# Altium project Ovladaci_karta.PrjPcb (part 1 of 2)
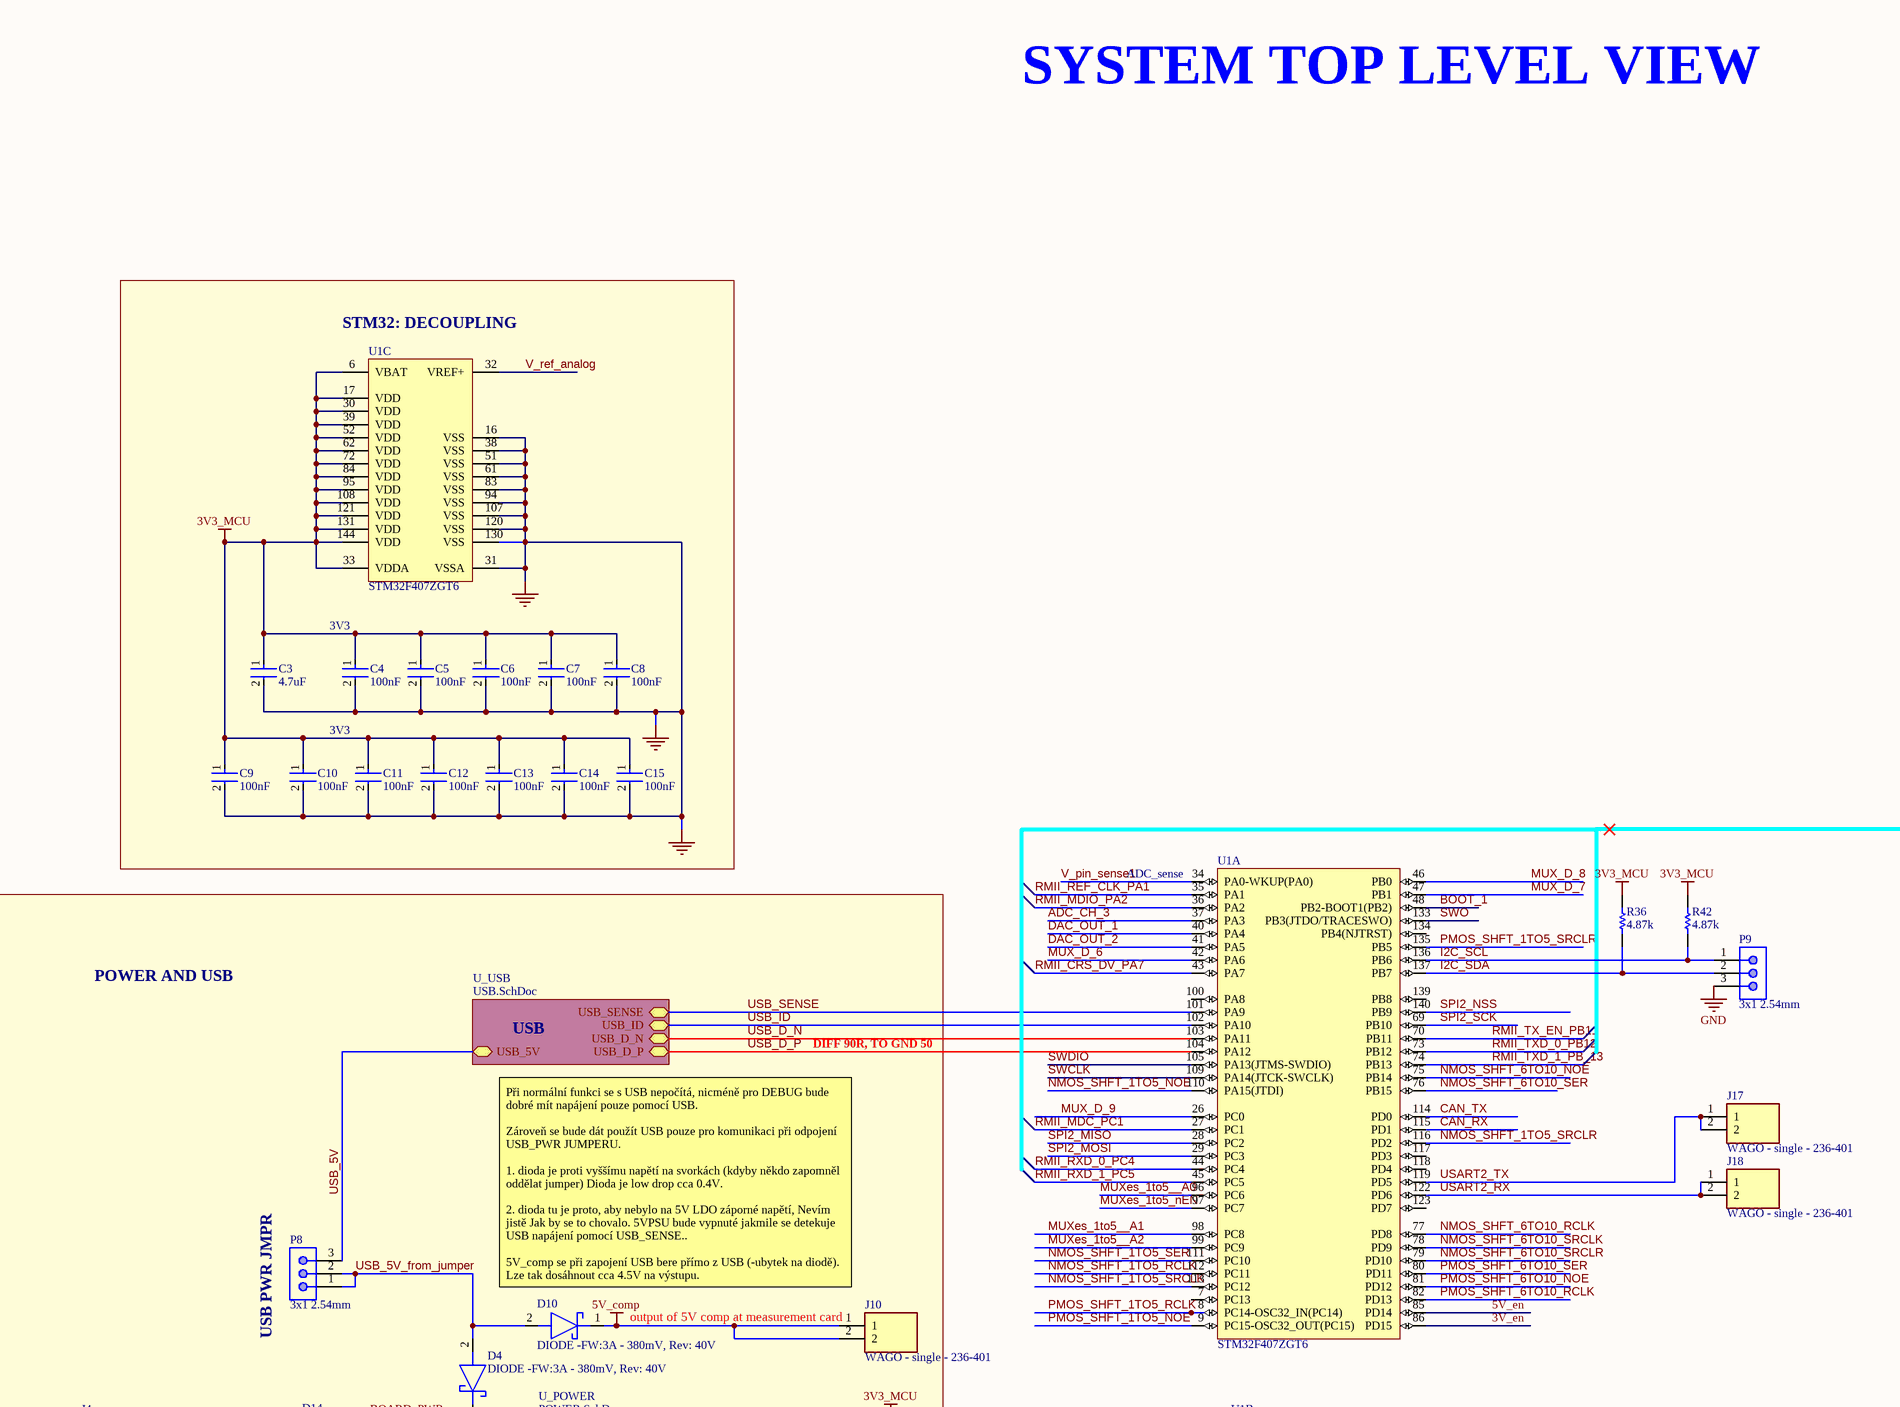
[diagram p0: main_scheme.SchDoc, top left]
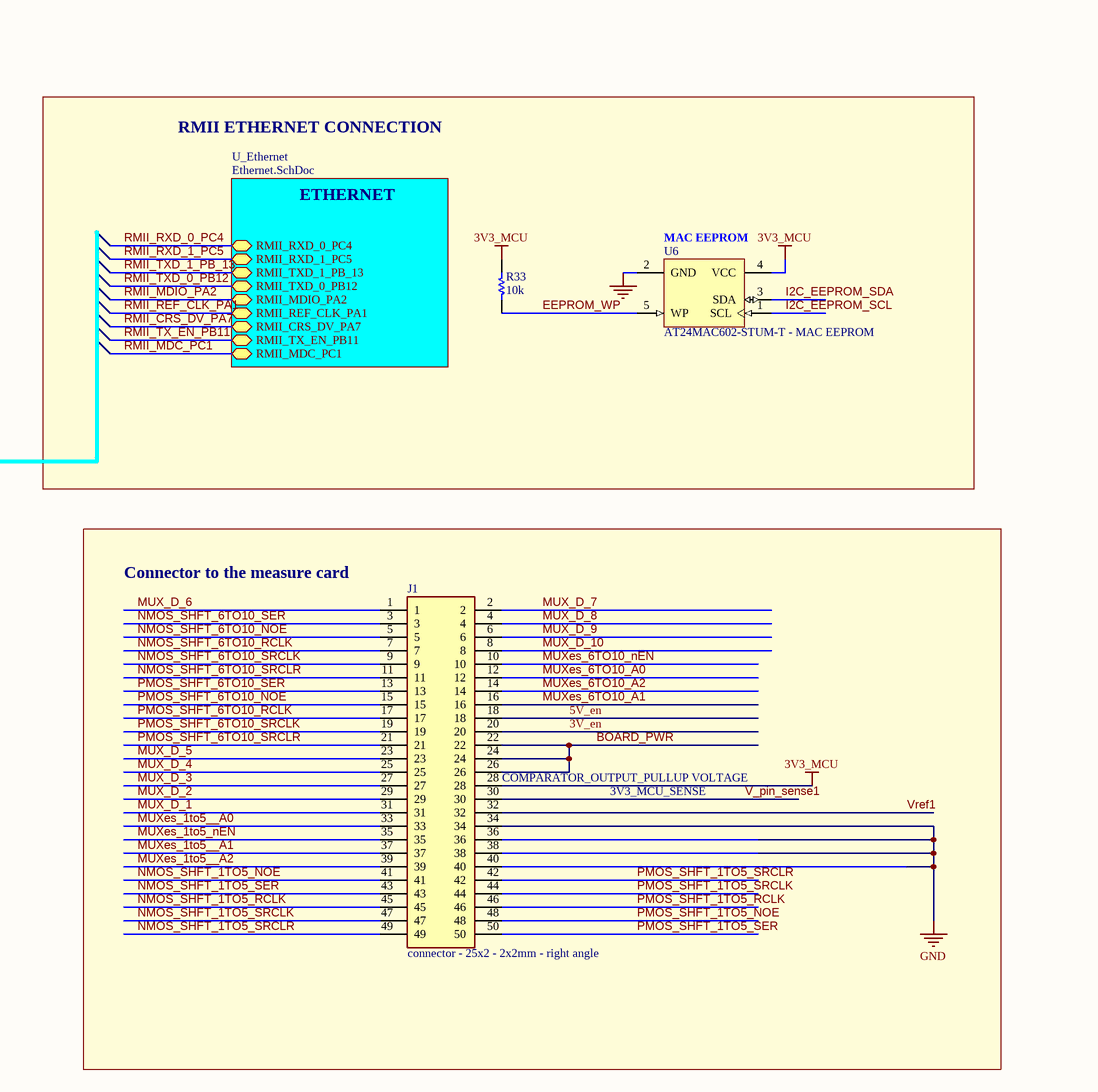
[diagram p1: main_scheme.SchDoc, top right]
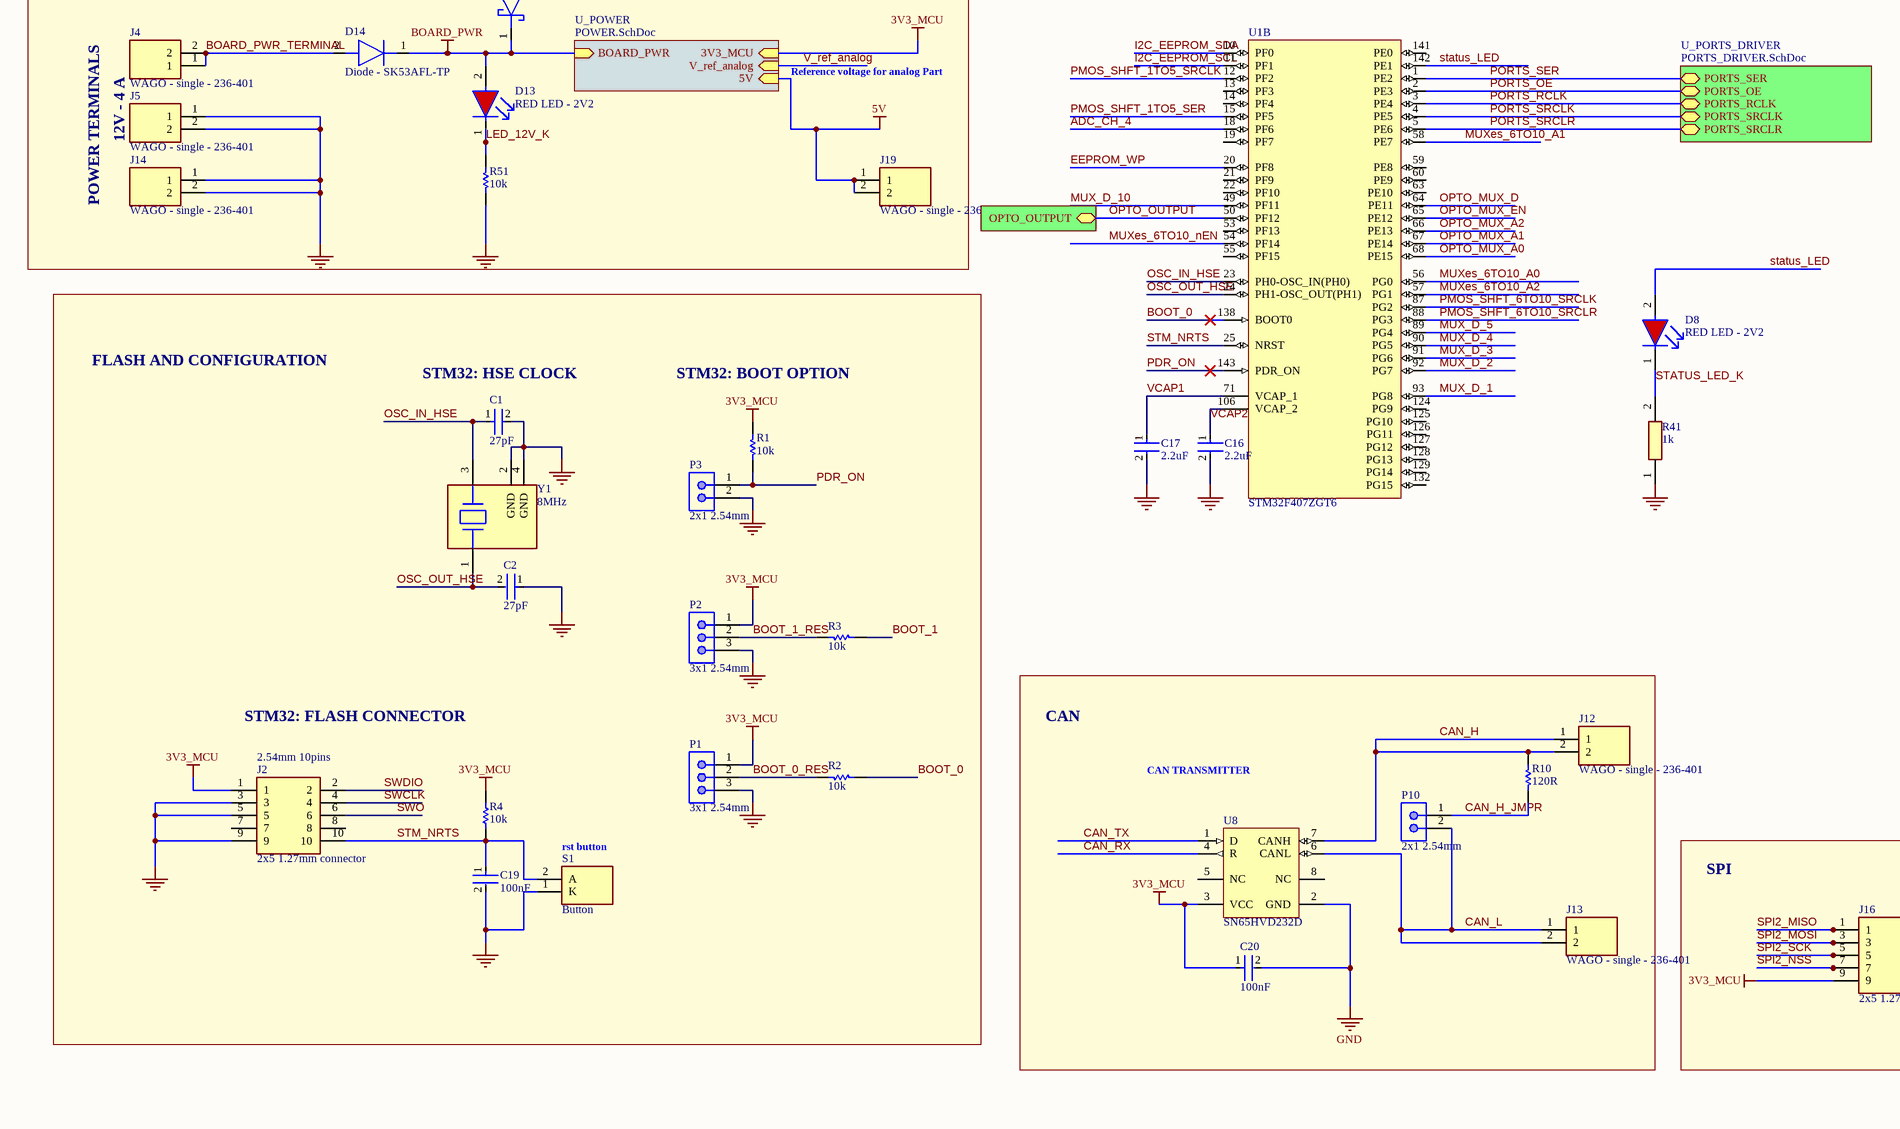
[diagram p2: main_scheme.SchDoc, bottom left]
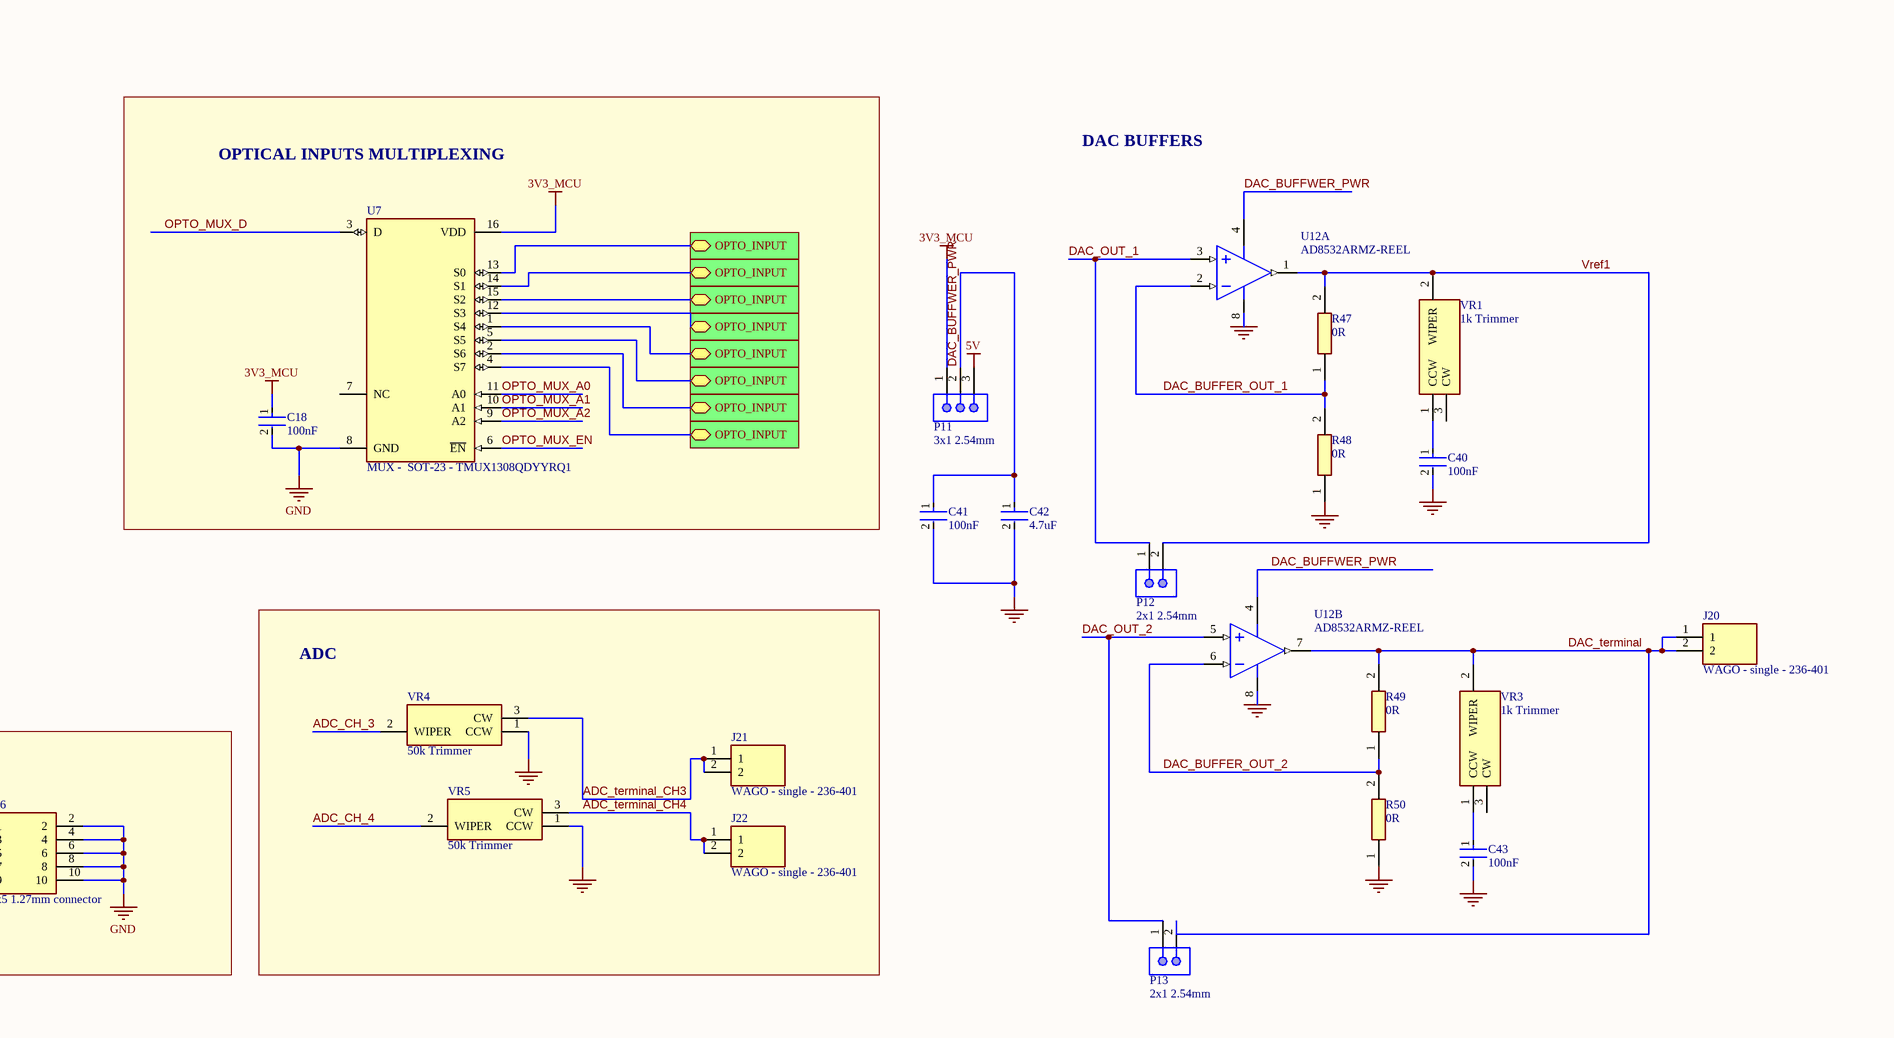
[diagram p3: main_scheme.SchDoc, bottom right]
8 sheets, 236 parts. Net scope: hierarchical (ports join the sheet entries above them; power ports are global).
Board file: PCB_ovladaci_karta.PcbDoc
Sheets:
  main_scheme.SchDoc
    U_POWER = POWER.SchDoc
    U_Ethernet = Ethernet.SchDoc
    U_USB = USB.SchDoc
    U_Opto_inputs = Opto_inputs.SchDoc
    U_Opto_inputs = Opto_inputs.SchDoc
    U_Opto_inputs = Opto_inputs.SchDoc
    U_Opto_inputs = Opto_inputs.SchDoc
    U_Opto_inputs = Opto_inputs.SchDoc
    U_Opto_inputs = Opto_inputs.SchDoc
    U_Opto_inputs = Opto_inputs.SchDoc
    U_Opto_inputs = Opto_inputs.SchDoc
    U_PORTS_DRIVER = PORTS_DRIVER.SchDoc
      U_PORT_SINGLE = PORT_SINGLE.SchDoc
      U_PORT_SINGLE = PORT_SINGLE.SchDoc
      U_PORT_SINGLE = PORT_SINGLE.SchDoc
    U_Opto_outputs = Opto_outputs.SchDoc

## Sheet main_scheme.SchDoc
size A1; DocumentNumber: 1; SheetNumber: 1; SheetTotal: 8

### Parts
C1  27pF  [0402 CAP]
C2  27pF  [0402 CAP]
C3  4.7uF  [0603-CAP]
C4  100nF  [0402 CAP]
C5  100nF  [0402 CAP]
C6  100nF  [0402 CAP]
C7  100nF  [0402 CAP]
C8  100nF  [0402 CAP]
C9  100nF  [0402 CAP]
C10  100nF  [0402 CAP]
C11  100nF  [0402 CAP]
C12  100nF  [0402 CAP]
C13  100nF  [0402 CAP]
C14  100nF  [0402 CAP]
C15  100nF  [0402 CAP]
C16  2.2uF  [0603-CAP]
C17  2.2uF  [0603-CAP]
C18  100nF  [0402 CAP]
C19  100nF  [0402 CAP]
C20  100nF  [0402 CAP]
C40  100nF  [0402 CAP]
C41  100nF  [0402 CAP]
C42  4.7uF  [0603-CAP]
C43  100nF  [0402 CAP]
D4  DIODE -FW:3A - 380mV, Rev: 40V  [DIONM5127X229N]
D8  RED LED - 2V2  [0603_RED_LED]
D10  DIODE -FW:3A - 380mV, Rev: 40V  [DIONM5127X229N]
D13  RED LED - 2V2  [0603_RED_LED]
D14  Diode - SK53AFL-TP  [SODFL5026X120N]
J1  connector - 25x2 - 2x2mm - right angle  [SHDRRA50W55P200_2X25_5265X640X630P_RIGHT]
J2  2x5 1.27mm connector  [FTSH-105-XX-YYY-D]
J4  WAGO - single - 236-401  [WAGO-236-601]
J5  WAGO - single - 236-401  [WAGO-236-601]
J10  WAGO - single - 236-401  [WAGO-236-601]
J12  WAGO - single - 236-401  [WAGO-236-601]
J13  WAGO - single - 236-401  [WAGO-236-601]
J14  WAGO - single - 236-401  [WAGO-236-601]
J16  2x5 1.27mm connector  [FTSH-105-XX-YYY-D]
J17  WAGO - single - 236-401  [WAGO-236-601]
J18  WAGO - single - 236-401  [WAGO-236-601]
J19  WAGO - single - 236-401  [WAGO-236-601]
J20  WAGO - single - 236-401  [WAGO-236-601]
J21  WAGO - single - 236-401  [WAGO-236-601]
J22  WAGO - single - 236-401  [WAGO-236-601]
P1  3x1 2.54mm  [3x1 2.54mm header]
P2  3x1 2.54mm  [3x1 2.54mm header]
P3  2x1 2.54mm  [2.54mm header 2x1]
P8  3x1 2.54mm  [3x1 2.54mm header]
P9  3x1 2.54mm  [3x1 2.54mm header]
P10  2x1 2.54mm  [2.54mm header 2x1]
P11  3x1 2.54mm  [3x1 2.54mm header]
P12  2x1 2.54mm  [2.54mm header 2x1]
P13  2x1 2.54mm  [2.54mm header 2x1]
R1  10k  [RESC1005X40X25NL05T05]
R2  10k  [RESC1005X40X25NL05T05]
R3  10k  [RESC1005X40X25NL05T05]
R4  10k  [RESC1005X40X25NL05T05]
R10  120R  [RESC1005X40X25NL05T05]
R33  10k  [RESC1005X40X25NL05T05]
R36  4.87k  [RESC1005X40X25NL05T05]
R41  1k  [0603- SMD resistor]
R42  4.87k  [RESC1005X40X25NL05T05]
R47  0R  [0603- SMD resistor]
R48  0R  [0603- SMD resistor]
R49  0R  [0603- SMD resistor]
R50  0R  [0603- SMD resistor]
R51  10k  [RESC1005X40X25NL05T05]
S1  Button  [B3U-1000P]
U1  STM32F407ZGT6  [STM-LQFP144_L]  (parts A,B,C of 3)
U6  AT24MAC602-STUM-T - MAC EEPROM  [ATML-5TS1_L]
U7  MUX -  SOT-23 - TMUX1308QDYYRQ1  [FP-DYY0016A-MFG]
U8  SN65HVD232D  [D0008A_L]
U12  AD8532ARMZ-REEL  [ADI-RM-8_L]  (parts A,B of 2)
VR1  1k Trimmer  [TC33X2503E]
VR3  1k Trimmer  [TC33X2503E]
VR4  50k Trimmer  [TC33X2503E]
VR5  50k Trimmer  [TC33X2503E]
Y1  8MHz  [4_pin_OSCILATOR]

### Blocks framed on the sheet
STM32: DECOUPLING: C3-C15 U1
Connector to the measure card: J1
OPTICAL INPUTS MULTIPLEXING: C18 U7
CAN: C20 J12 J13 P10 R10 U8
ADC: J21 J22 VR4 VR5
SPI: J16

### Sub-sheets
U_Ethernet = Ethernet.SchDoc: RMII_RXD_0_PC4 (bidir), RMII_RXD_1_PC5 (bidir), RMII_TXD_1_PB_13 (bidir), RMII_TXD_0_PB12 (bidir), RMII_MDIO_PA2 (bidir), RMII_REF_CLK_PA1 (bidir), RMII_CRS_DV_PA7 (bidir), RMII_TX_EN_PB11 (bidir), RMII_MDC_PC1 (bidir)
U_Opto_inputs = Opto_inputs.SchDoc: OPTO_INPUT (bidir)
U_Opto_inputs = Opto_inputs.SchDoc: OPTO_INPUT (bidir)
U_Opto_inputs = Opto_inputs.SchDoc: OPTO_INPUT (bidir)
U_Opto_inputs = Opto_inputs.SchDoc: OPTO_INPUT (bidir)
U_Opto_inputs = Opto_inputs.SchDoc: OPTO_INPUT (bidir)
U_Opto_inputs = Opto_inputs.SchDoc: OPTO_INPUT (bidir)
U_Opto_inputs = Opto_inputs.SchDoc: OPTO_INPUT (bidir)
U_Opto_inputs = Opto_inputs.SchDoc: OPTO_INPUT (bidir)
U_Opto_outputs = Opto_outputs.SchDoc: OPTO_OUTPUT (bidir)
U_PORTS_DRIVER = PORTS_DRIVER.SchDoc: PORTS_SER (bidir), PORTS_SRCLR (bidir), PORTS_RCLK (bidir), PORTS_SRCLK (bidir), PORTS_OE (bidir)
U_POWER = POWER.SchDoc: 3V3_MCU (in), BOARD_PWR (in), V_ref_analog (in), 5V (in)
U_USB = USB.SchDoc: USB_5V (bidir), USB_D_P (bidir), USB_D_N (bidir), USB_ID (bidir), USB_SENSE (bidir)

### Nets
3V3_MCU: C3.1 C4.1 C5.1 C6.1 C7.1 C8.1 C9.1 C10.1 C11.1 C12.1 C13.1 C14.1 C15.1 C18.1 C20.1 J1.28 J2.1 J16.9 P1.1 P2.1 P11.1 R1.1 R4.1 R33.1 R36.1 R42.1 U1.6(VBAT) U1.17(VDD) U1.30(VDD) U1.33(VDDA) U1.39(VDD) U1.52(VDD) U1.62(VDD) U1.72(VDD) U1.84(VDD) U1.95(VDD) U1.108(VDD) U1.121(VDD) U1.131(VDD) U1.144(VDD) U6.4(VCC) U7.16(VDD) U8.3(VCC) ; sheet U_POWER/3V3_MCU
5V: J19.1 J19.2 P11.3 ; sheet U_POWER/5V
5V_comp: D10.1(K) J10.1 J10.2
BOARD_PWR: D4.1(K) D13.2(A) D14.1(K) J1.22 J1.24 J1.26 ; sheet U_POWER/BOARD_PWR
GND: C1.2 C2.1 C3.2 C4.2 C5.2 C6.2 C7.2 C8.2 C9.2 C10.2 C11.2 C12.2 C13.2 C14.2 C15.2 C16.2 C17.2 C18.2 C19.2 C20.2 C40.2 C41.2 C42.2 C43.2 J1.34 J1.36 J1.38 J1.40 J2.3 J2.5 J2.9 J5.1 J5.2 J14.1 J14.2 J16.2 J16.4 J16.6 J16.8 J16.10 P1.3 P2.3 P3.2 P9.3 R41.1 R48.1 R50.1 R51.1 S1.1(K) U1.16(VSS) U1.31(VSSA) U1.38(VSS) U1.51(VSS) U1.61(VSS) U1.83(VSS) U1.94(VSS) U1.107(VSS) U1.120(VSS) U1.130(VSS) U6.2(GND) U7.8(GND) U8.2(GND) U12.8(+V) VR4.1(CCW) VR5.1(CCW) Y1.2(GND) Y1.4(GND)
3V_en: J1.20 U1.86(PD15)
5V_en: J1.18 U1.85(PD14)
ADC_CH_3: U1.37(PA3) VR4.2(WIPER)
ADC_CH_4: U1.18(PF6) VR5.2(WIPER)
ADC_terminal_CH3: J21.1 J21.2 VR4.3(CW)
ADC_terminal_CH4: J22.1 J22.2 VR5.3(CW)
BOARD_PWR_TERMINAL: D14.2(A) J4.1 J4.2
BOOT_0: R2.2 U1.138(BOOT0)
BOOT_0_RES: P1.2 R2.1
BOOT_1: R3.2 U1.48(PB2-BOOT1(PB2))
BOOT_1_RES: P2.2 R3.1
CAN_H: J12.1 J12.2 R10.2 U8.7(CANH)
CAN_H_JMPR: P10.1 R10.1
CAN_L: J13.1 J13.2 P10.2 U8.6(CANL)
CAN_RX: U1.115(PD1) U8.4(R)
CAN_TX: U1.114(PD0) U8.1(D)
DAC_BUFFER_OUT_1: R47.1 R48.2 U12.2(-IN_A)
DAC_BUFFER_OUT_2: R49.1 R50.2 U12.6(-IN_B)
DAC_BUFFWER_PWR: C41.1 C42.1 P11.2 U12.4(-V)
DAC_OUT_1: P12.1 U1.40(PA4) U12.3(+IN_A)
DAC_OUT_2: P13.1 U1.41(PA5) U12.5(+IN_B)
DAC_terminal: J20.1 J20.2 P13.2 R49.2 U12.7(OUT_B) VR3.2(WIPER)
EEPROM_WP: R33.2 U1.20(PF8) U6.5(WP)
I2C_EEPROM_SCL: U1.11(PF1) U6.1(SCL)
I2C_EEPROM_SDA: U1.10(PF0) U6.3(SDA)
I2C_SCL: P9.1 R42.2 U1.136(PB6)
I2C_SDA: P9.2 R36.2 U1.137(PB7)
LED_12V_K: D13.1(C) R51.2
MUX_D_1: J1.31 U1.93(PG8)
MUX_D_2: J1.29 U1.92(PG7)
MUX_D_3: J1.27 U1.91(PG6)
MUX_D_4: J1.25 U1.90(PG5)
MUX_D_5: J1.23 U1.89(PG4)
MUX_D_6: J1.1 U1.42(PA6)
MUX_D_7: J1.2 U1.47(PB1)
MUX_D_8: J1.4 U1.46(PB0)
MUX_D_9: J1.6 U1.26(PC0)
MUX_D_10: J1.8 U1.49(PF11)
MUXes_1to5__A0: J1.33 U1.96(PC6)
MUXes_1to5__A1: J1.37 U1.98(PC8)
MUXes_1to5__A2: J1.39 U1.99(PC9)
MUXes_1to5_nEN: J1.35 U1.97(PC7)
MUXes_6TO10_A0: J1.12 U1.56(PG0)
MUXes_6TO10_A1: J1.16 U1.58(PE7)
MUXes_6TO10_A2: J1.14 U1.57(PG1)
MUXes_6TO10_nEN: J1.10 U1.54(PF14)
NMOS_SHFT_1TO5_NOE: J1.41 U1.110(PA15(JTDI))
NMOS_SHFT_1TO5_RCLK: J1.45 U1.112(PC11)
NMOS_SHFT_1TO5_SER: J1.43 U1.111(PC10)
NMOS_SHFT_1TO5_SRCLK: J1.47 U1.113(PC12)
NMOS_SHFT_1TO5_SRCLR: J1.49 U1.116(PD2)
NMOS_SHFT_6TO10_NOE: J1.5 U1.75(PB14)
NMOS_SHFT_6TO10_RCLK: J1.7 U1.77(PD8)
NMOS_SHFT_6TO10_SER: J1.3 U1.76(PB15)
NMOS_SHFT_6TO10_SRCLK: J1.9 U1.78(PD9)
NMOS_SHFT_6TO10_SRCLR: J1.11 U1.79(PD10)
OPTO_MUX_A0: U1.68(PE15) U7.11(A0)
OPTO_MUX_A1: U1.67(PE14) U7.10(A1)
OPTO_MUX_A2: U1.66(PE13) U7.9(A2)
OPTO_MUX_D: U1.64(PE11) U7.3(D)
OPTO_MUX_EN: U1.65(PE12) U7.6(~{EN})
OPTO_OUTPUT: U1.50(PF12) ; sheet U_Opto_outputs/OPTO_OUTPUT
OSC_IN_HSE: C1.1 U1.23(PH0-OSC_IN(PH0)) Y1.3
OSC_OUT_HSE: C2.2 U1.24(PH1-OSC_OUT(PH1)) Y1.1
PDR_ON: P3.1 R1.2 U1.143(PDR_ON)
PMOS_SHFT_1TO5_NOE: J1.48 U1.9(PC15-OSC32_OUT(PC15))
PMOS_SHFT_1TO5_RCLK: J1.46 U1.8(PC14-OSC32_IN(PC14))
PMOS_SHFT_1TO5_SER: J1.50 U1.15(PF5)
PMOS_SHFT_1TO5_SRCLK: J1.44 U1.12(PF2)
PMOS_SHFT_1TO5_SRCLR: J1.42 U1.135(PB5)
PMOS_SHFT_6TO10_NOE: J1.15 U1.81(PD12)
PMOS_SHFT_6TO10_RCLK: J1.17 U1.82(PD13)
PMOS_SHFT_6TO10_SER: J1.13 U1.80(PD11)
PMOS_SHFT_6TO10_SRCLK: J1.19 U1.87(PG2)
PMOS_SHFT_6TO10_SRCLR: J1.21 U1.88(PG3)
PORTS_OE: U1.2(PE3) ; sheet U_PORTS_DRIVER/PORTS_OE
PORTS_RCLK: U1.3(PE4) ; sheet U_PORTS_DRIVER/PORTS_RCLK
PORTS_SER: U1.1(PE2) ; sheet U_PORTS_DRIVER/PORTS_SER
PORTS_SRCLK: U1.4(PE5) ; sheet U_PORTS_DRIVER/PORTS_SRCLK
PORTS_SRCLR: U1.5(PE6) ; sheet U_PORTS_DRIVER/PORTS_SRCLR
RMII_CRS_DV_PA7: U1.43(PA7) ; sheet U_Ethernet/RMII_CRS_DV_PA7
RMII_MDC_PC1: U1.27(PC1) ; sheet U_Ethernet/RMII_MDC_PC1
RMII_MDIO_PA2: U1.36(PA2) ; sheet U_Ethernet/RMII_MDIO_PA2
RMII_REF_CLK_PA1: U1.35(PA1) ; sheet U_Ethernet/RMII_REF_CLK_PA1
RMII_RXD_0_PC4: U1.44(PC4) ; sheet U_Ethernet/RMII_RXD_0_PC4
RMII_RXD_1_PC5: U1.45(PC5) ; sheet U_Ethernet/RMII_RXD_1_PC5
RMII_TX_EN_PB11: U1.70(PB11) ; sheet U_Ethernet/RMII_TX_EN_PB11
RMII_TXD_0_PB12: U1.73(PB12) ; sheet U_Ethernet/RMII_TXD_0_PB12
RMII_TXD_1_PB_13: U1.74(PB13) ; sheet U_Ethernet/RMII_TXD_1_PB_13
SPI2_MISO: J16.1 U1.28(PC2)
SPI2_MOSI: J16.3 U1.29(PC3)
SPI2_NSS: J16.7 U1.140(PB9)
SPI2_SCK: J16.5 U1.69(PB10)
status_LED: D8.2(A) U1.142(PE1)
STATUS_LED_K: D8.1(C) R41.2
STM_NRTS: C19.1 J2.10 R4.2 S1.2(A) U1.25(NRST)
SWCLK: J2.4 U1.109(PA14(JTCK-SWCLK))
SWDIO: J2.2 U1.105(PA13(JTMS-SWDIO))
SWO: J2.6 U1.133(PB3(JTDO/TRACESWO))
USART2_RX: J18.1 J18.2 U1.122(PD6)
USART2_TX: J17.1 J17.2 U1.119(PD5)
USB_5V: P8.3 ; sheet U_USB/USB_5V
USB_5V_from_jumper: D4.2(A) D10.2(A) P8.1 P8.2
USB_D_N: U1.103(PA11) ; sheet U_USB/USB_D_N
USB_D_P: U1.104(PA12) ; sheet U_USB/USB_D_P
USB_ID: U1.102(PA10) ; sheet U_USB/USB_ID
USB_SENSE: U1.101(PA9) ; sheet U_USB/USB_SENSE
V_pin_sense1: J1.30 U1.34(PA0-WKUP(PA0))
V_ref_analog: U1.32(VREF+) ; sheet U_POWER/V_ref_analog
VCAP1: C17.1 U1.71(VCAP_1)
VCAP2: C16.1 U1.106(VCAP_2)
Vref1: J1.32 P12.2 R47.2 U12.1(OUT_A) VR1.2(WIPER)
NetC40_1: C40.1 VR1.1(CCW)
NetC43_1: C43.1 VR3.1(CCW)
NetR6_U_Opto_inputs#1_2: U7.13(S0) ; sheet U_Opto_inputs/OPTO_INPUT
NetR6_U_Opto_inputs#2_2: U7.14(S1) ; sheet U_Opto_inputs/OPTO_INPUT
NetR6_U_Opto_inputs#3_2: U7.15(S2) ; sheet U_Opto_inputs/OPTO_INPUT
NetR6_U_Opto_inputs#4_2: U7.12(S3) ; sheet U_Opto_inputs/OPTO_INPUT
NetR6_U_Opto_inputs#5_2: U7.1(S4) ; sheet U_Opto_inputs/OPTO_INPUT
NetR6_U_Opto_inputs#6_2: U7.5(S5) ; sheet U_Opto_inputs/OPTO_INPUT
NetR6_U_Opto_inputs#7_2: U7.2(S6) ; sheet U_Opto_inputs/OPTO_INPUT
NetR6_U_Opto_inputs#8_2: U7.4(S7) ; sheet U_Opto_inputs/OPTO_INPUT

Not connected (* = marked no-connect by the designer): J2 7 8; U1 7(PC13) 13(PF3) 14(PF4) 19(PF7) 21(PF9) 22(PF10) 53(PF13) 55(PF15) 59(PE8) 60(PE9) 63(PE10) 100(PA8) 117(PD3) 118(PD4) 123(PD7) 124(PG9) 125(PG10) 126(PG11) 127(PG12) 128(PG13) 129(PG14) 132(PG15) 134(PB4(NJTRST)) 139(PB8) 141(PE0); U7 7(NC); U8 5(NC) 8(NC); VR1 3(CW); VR3 3(CW)

### Notes on the sheet
- SYSTEM TOP LEVEL VIEW
- RMII ETHERNET CONNECTION
- ETHERNET
- 3V3
- (near U6) MAC EEPROM
- (near U1) ADC_sense
- POWER AND USB
- USB
- DIFF 90R, TO GND 50
- (near J1) COMPARATOR_OUTPUT_PULLUP VOLTAGE
- 3V3_MCU_SENSE
- Při normální funkci se s USB nepočítá, nicméně pro DEBUG bude dobré mít napájení pouze pomocí USB.
  Zároveň se bude dát použít USB pouze pro komunikaci při odpojení
  USB_PWR JUMPERU.
  1. dioda je proti vyššímu napětí na svorkách (kdyby někdo zapomněl oddělat jumper) Dioda je low drop cca 0.4V.
  2. dioda tu je proto, aby nebylo na 5V LDO záporné napětí, Nevím jistě Jak by se to chovalo. 5VPSU bude vypnuté jakmile se detekuje USB napájení pomocí USB_SENSE..
  5V_comp se při zapojení USB bere přímo z USB (-ubytek na diodě). Lze tak dosáhnout cca 4.5V na výstupu.
  4.4 by snad mělo stačit, aby LDO udrželo alespoň 3V3 na výstupu při 1A
- (near P8) USB PWR JMPR
- (near J10) output of 5V comp at measurement card
- Reference voltage for analog Part
- 12V - 4 A
- POWER TERMINALS
- DAC BUFFERS
- FLASH AND CONFIGURATION
- (near C1) STM32: HSE CLOCK
- STM32: BOOT OPTION
- STM32: FLASH CONNECTOR
- (near J2) 2.54mm 10pins
- CAN TRANSMITTER
- (near S1) rst button

### Library data of the parts
C1 C2 = CAP 0402 - 27pF: Cap Ceramic 0402, 27pF, 25V,10%; PartNumber: C0402C270K3GACTU; Value: 27pF; Package: 0402; Supplier 1: Mouser; Supplier Part Number 1: 80-C0402C270K3G; ComponentLink1Description: myLinks; ComponentLink1URL: https://eu.mouser.com/ProductDetail/KEMET/C0402C270K3GACTU?qs=v7s4VpRpa0t5WS52qYyghQ%3D%3D
C3 C42 = CAP-0603-4.7uF: General Purpose Ceramic Capacitor, 0603,4.7uF,35V,10%; PartNumber: C1608X5R1V475K080AC; ComponentLink1Description: myLinks; ComponentLink1URL: https://cz.mouser.com/ProductDetail/TDK/C1608X5R1V475K080AC?qs=dfay7wIA1uF9DVjUL4K4oA%3D%3D; Package: 0603; Value: 4.7uF; Supplier 1: Mouser; Supplier Part Number 1: 810-C1608X5R1V475K
C4-C15 C18-C20 C40 C41 C43 = CAP 0402 - 100nF: Cap Ceramic 0402,0.1uF, 25V,10%; PartNumber: C0402C104K3RACTU; Value: 100nF; Package: 0402; Supplier 1: Mouser; Supplier Part Number 1: 80-C0402C104K3R; ComponentLink1Description: myLinks; ComponentLink1URL: https://eu.mouser.com/ProductDetail/KEMET/C0402C104K3RACTU?qs=YCcZ0GhAU2q7BaxZ%2FluQHA%3D%3D
C16 C17 = CAP-0603-2.2uF: General Purpose Ceramic Capacitor, 0603,2.2uF,35V,10%; PartNumber: C1608JB1V225K080AC; ComponentLink1Description: myLinks; ComponentLink1URL: https://cz.mouser.com/ProductDetail/TDK/C1608JB1V225K080AC?qs=xLDY6iXSiQbY%2FrhN9AA4AA%3D%3D; Package: 0603; Value: 2.2uF; Supplier 1: Mouser; Supplier Part Number 1: 810-C1608JB1V225K08C
D4 D10 = DIODE -FW:3A - 380mV, Rev: 40V: Schottky DIODE -  DO-214AC-2 -FW:3A - 380mV, Rev: 40V; PartNumber: SSA34HE3_A/I; ComponentLink1Description: New link; ComponentLink1URL: https://cz.mouser.com/ProductDetail/Vishay-General-Semiconductor/SSA34HE3_A-I?qs=asPD7ZL2j3VimMFbwwU%2FoA%3D%3D; Value: FW:3A - 380mV, Rev: 40V; Package: DO-214AC-2; Supplier 1: Mouser; Supplier Part Number 1: 78-SSA34HE3_A/I
D8 D13 = LED - 0603 - RED - 2V2: LED RED DIFFUSED 0603 SMD; PartNumber: SML-D12U1WT86; Value: RED LED - 2.2V; Package: 0602; ComponentLink1Description: myLinks; ComponentLink1URL: https://cz.mouser.com/ProductDetail/ROHM-Semiconductor/SML-D12U1WT86?qs=M3jcYzEJUdEySuGkbjHEtQ%3D%3D; Supplier 1: Mouser; Supplier Part Number 1: 755-SML-D12U1WT86
D14 = Diode - SK53AFL-TP: Diode - 5A shottky Rectifier, Fw: 5A, 0.7V Revers: 30V, DO-221AC-2; Value: Fw: 5A, 0.7V Revers: 30V; Package: DO-221AC-2; PartNumber: SK53AFL-TP; ComponentLink1Description: myLinks; ComponentLink1URL: https://cz.mouser.com/ProductDetail/Micro-Commercial-Components-MCC/SK53AFL-TP?qs=sGAEpiMZZMtbRapU8LlZD%252B6h%2FWulpAkrF6E5wLTt2R0xTCwpYWNMog%3D%3D; Supplier 1: Mouser; Supplier Part Number 1: 833-SK53AFL-TP
J1 = connector - 25x2 - 2x2mm - right angle: Connector - connector - 25x2 - 2x2mm, SAMTEC - right angle; PartNumber: STMM-125-02-S-D-RA; ComponentLink1Description: myLinks; ComponentLink1URL: https://cz.mouser.com/ProductDetail/Samtec/STMM-125-02-S-D-RA?qs=rU5fayqh%252BE3bRISkmlmqKg%3D%3D; Value: 25x2 - 2x2mm -right angle; Package: 25x2 - 2x2mm -right angle; Supplier 1: Mouser; Supplier Part Number 1: 200-STMM12502SDRA
J2 J16 = Connector - 2x5 -1.27 x 1.27mm: Connector - 2x5positions -  1.27mm x1.27mm; PartNumber: FTSH-105-04-F-D; Value: 2x5 1.27mm x 1.27mm; Package: 2x5positions -  1.27mm x1.27mm; ComponentLink1Description: myLinks; ComponentLink1URL: https://cz.mouser.com/ProductDetail/Samtec/FTSH-105-04-F-D?qs=0lQeLiL1qyZx0H067ICkhw%3D%3D; Supplier 1: Mouser; Supplier Part Number 1: 200-FTSH10504FDV
J4 J5 J10 J12-J14 J17-J22 = WAGO - single - 236-401: Wago connector - PCB to wire - single - 24A 320V; ComponentLink1Description: myLinks; ComponentLink1URL: https://cz.farnell.com/wago/236-401/terminal-block-wire-to-brd-1pos/dp/1891620?gclid=CjwKCAiAu5agBhBzEiwAdiR5tFj9uwuLgrlShO914YuSUEtsU0o4Hiox7ZjRnpSnFBbtyRYLbKYJWxoC0xgQAvD_BwE&mckv=sEoohdYPd_dc|pcrid|263733373421|kword|+wago%20+236-401|match|b|plid||slid||product||pgrid|56870816529|ptaid|kwd-298399736559|&CMP=KNC-GCZ-GEN-SKU-MDC; Value: 24A 320V; Package: 236-401; PartNumber: 236-401; Supplier 1: Farnell; Supplier Part Number 1: 1891620
P1 P2 P8 P9 P11 = Header - 3x1 2.54mm: Headers & Wire Housings 3P HEADER GOLD 15u single row; PartNumber: 5-146280-3; Value: 3x1 2.54mm; Package: 3x1 2.54mm; ComponentLink1Description: myLinks; ComponentLink1URL: https://cz.mouser.com/ProductDetail/TE-Connectivity/5-146280-3?qs=bwpFY26eRVf7xnwkMZzVxA%3D%3D; Supplier 1: Mouser; Supplier Part Number 1: 571-5-146280-3
P3 P10 P12 P13 = Header - 2x1 2.54mm: Male Header, Pitch 2.54 mm, 1 x 2 Position, Height 8.21 mm, Tail Length 3.05 mm, -65 to 105 degC, RoHS, Bulk; PartNumber: 5-146280-2; ComponentLink1Description: myLinks; ComponentLink1URL: https://cz.mouser.com/ProductDetail/TE-Connectivity/5-146280-2?qs=bwpFY26eRVcxHP%252BQexhLNQ%3D%3D; Value: 2x1 2.54mm; Package: 2x1 2.54mm; Supplier 1: Mouser; Supplier Part Number 1: 571-5-146280-2
R1-R4 R33 R51 = Resistor - 0402 -10k: Resistor - 0402 -  10k - 5% - 125mW; PartNumber: RC0402JR-7W10KL; Value: 10k; Package: 0402; ComponentLink1Description: myLinks; ComponentLink1URL: https://cz.mouser.com/ProductDetail/YAGEO/RC0402JR-7W10KL?qs=tggtontpCXPnY%2FhgQXv%2FLg%3D%3D; Supplier 1: Mouser; Supplier Part Number 1: 603-RC0402JR-7W10KL
R10 = Resistor - 0402 -120R: Resistor - 0402 -  120R - 1% - 100mW; PartNumber: ERJ-S02F1200X; Value: 120R; Package: 0402; ComponentLink1Description: myLinks; ComponentLink1URL: https://cz.mouser.com/ProductDetail/Panasonic/ERJ-S02F1200X?qs=Zyl8A9hlmJqrTWz%252BBOpJnw%3D%3D; Supplier 1: Mouser; Supplier Part Number 1: 667-ERJ-S02F1200X
R36 R42 = Resistor - 0402 - 4.87k: Resistor - 0402 -  4.87k - 1% - 100mW; PartNumber: ERJ-2RKF4871X; Value: 4.87k; Package: 0402; ComponentLink1Description: myLinks; ComponentLink1URL: https://cz.mouser.com/ProductDetail/Panasonic/ERJ-2RKF4871X?qs=YMBIwoNQYdV9ZzOLxQ6NUw%3D%3D; Supplier 1: Mouser; Supplier Part Number 1: 667-ERJ-2RKF4871X
R41 = RESISTOR - 0603 - 1k: Resistor 0603 1KR 100mW 1%; PartNumber: RT0603FRE071KL; ComponentLink1Description: myLinks; ComponentLink1URL: https://cz.mouser.com/ProductDetail/YAGEO/RT0603FRE071KL?qs=8cPjvKtxWv68ZVEzoi6JxQ%3D%3D; Value: 1k; Package: 0603; Supplier 1: Mouser; Supplier Part Number 1: 603-RT0603FRE071KL
R47-R50 = RESISTOR - 0603 - 0R: Resistor 0603 0R; PartNumber: ERJ-3GEY0R00V; ComponentLink1Description: myLinks; ComponentLink1URL: https://cz.mouser.com/ProductDetail/Panasonic/ERJ-3GEY0R00V?qs=66DK8nO8gJALIOqOWgiVwg%3D%3D; Value: 0R; Package: 0603; Supplier 1: Mouser; Supplier Part Number 1: 667-ERJ-3GEY0R00V
S1 = Button - smd -2 poles: Push button - 2poles,  L:2.5mm, W:3mm, H:1.2mm, 12VDC - 50mA; Value: 2 poles button - 12V 50mA; ComponentLink1Description: myLinks; ComponentLink1URL: https://www.mouser.co.uk/ProductDetail/Omron-Electronics/B3U-1000P?qs=AO7BQMcsEu4ip80xyf2FwA%3D%3D; Package: L:2.5mm, W:3mm, H:1.2mm; PartNumber: B3U-1000P; Supplier 1: Mouser; Supplier Part Number 1: 653-B3U-1000P
U1 = STM32F407ZGT6: ARM Cortex-M4 32-bit MCU+FPU, 210 DMIPS, 1024 kB Flash, 192 kB Internal RAM, 114 I/Os, 144-pin LQFP, -40 to 85 degC, Tray; Value: Cortex - M4 uC; PartNumber: STM32F407ZGT6; ComponentLink1URL: https://cz.mouser.com/ProductDetail/STMicroelectronics/STM32F407ZGT6?qs=Z8%252BeY1k3TIKo142SZNWnSQ%3D%3D; ComponentLink1Description: myLinks; Package: LQFP144; Supplier 1: Mouser; Supplier Part Number 1: 511-STM32F407ZGT6
U6 = MAC_EEPROM_I2C: 2-Kbit (256 x 8), 2-wire Serial EEPROM with a Factory-Programmed EUI-64(TM)Address Plus an Embedded Unique 128-bit Serial Number, 1.7 to 5.5 V, -40 to 85 degC, 5-Pin SOT23 (5TS1), Tape and Reel; Value: EEPROM, 2-Kbit, I2C, with MAC; Package: SOT-23-5; PartNumber: AT24MAC602-STUM-T; ComponentLink1Description: myLinks; ComponentLink1URL: https://cz.mouser.com/ProductDetail/Microchip-Technology-Atmel/AT24MAC602-STUM-T?qs=s44pgLhgXQiuNdSpdYyLLA%3D%3D; Supplier 1: Mouser; Supplier Part Number 1: 556-AT24MAC602-STUMT
U7 = MUX -  SOT-23 - TMUX1308QDYYRQ1: Multiplexer Switch ICs Automotive 5-V, 8:1, 1-channel multiplexer with injection current control and 1.8V logic 16-SOT-23-THN -40 to 125; Value: 8:1 MUX; ComponentLink1Description: myLinks; ComponentLink1URL: https://cz.mouser.com/ProductDetail/Texas-Instruments/TMUX1308QDYYRQ1?qs=xZ%2FP%252Ba9zWqaqz9D2kpWQ%2FA%3D%3D; Package: SOT-23-THIN-16; PartNumber: TMUX1308QDYYRQ1; Supplier 1: Mouser; Supplier Part Number 1: 595-TMUX1308QDYYRQ1
U8 = CAN - PHY - SN65HVD232D: 3.3 V CAN Transceiver, 17 mA, -40 to 85 degC, 8-pin SOIC (D), Green (RoHS & no Sb/Br); Value: 1Mbit CAN , 3-3.6VDC; PartNumber: SN65HVD232D; Package: SOIC-8; Supplier 1: Mouser; Supplier Part Number 1: 595-SN65HVD232D; ComponentLink1Description: myLinks; ComponentLink1URL: https://eu.mouser.com/ProductDetail/Texas-Instruments/SN65HVD232D?qs=QViXGNcIEAueLIS9b8IyYg%3D%3D
U12 = OPAMP - 2CH AD8532ARMZ-REEL: Double Channel Rail-to-Rail Operational Amplifier, 3 MHz BW, 5 V/us SR, Industrial, 8-pin SOP (RM-8), Reel; Value: RAIL TO RAIL OPAMP 3-6V; PartNumber: AD8532ARMZ-REEL; ComponentLink1Description: myLinks; ComponentLink1URL: https://cz.mouser.com/ProductDetail/Analog-Devices/AD8532ARMZ-REEL?qs=%2FtpEQrCGXCwVVXkbCBPc6A%3D%3D; Package: MSOP-8; Supplier 1: Mouser; Supplier Part Number 1: 584-AD8532ARMZ-R
VR1 VR3 = TRIMMER - 1k -100mW: Variable Resistor Trimmer - 1k - 25% -100mW - single turn; PartNumber: TC33X-2-102E; Package: 3mm SMD TRIMPOT; Value: 1k; ComponentLink1Description: myLinks; ComponentLink1URL: https://cz.mouser.com/ProductDetail/Bourns/TC33X-2-102E?qs=2hAPiALdQ0nRULMRC6GCtg%3D%3D; Supplier 1: Mouser; Supplier Part Number 1: 652-TC33X-2-102E
VR4 VR5 = TRIMMER - 50k -100mW: Variable Resistor Trimmer - 50k - 25% -100mW - single turn; PartNumber: TC33X-2-102E; Package: 3mm SMD TRIMPOT; Value: 50k; ComponentLink1Description: myLinks; ComponentLink1URL: https://cz.mouser.com/ProductDetail/Bourns/TC33X-2-503E?qs=tEaODSGlU8NgxHjveDtEEg%3D%3D; Supplier 1: Mouser; Supplier Part Number 1: 652-TC33X-2-102E
Y1 = 8MHz-Osc: Crystal 8MHz ±10ppm CL=18pF SMD-4 5mm x 3.2mm; PartNumber: ABM3B-8.000MHZ-D2-T; ComponentLink1Description: myLinks; ComponentLink1URL: https://cz.mouser.com/ProductDetail/ABRACON/ABM3B-8.000MHZ-D2-T?qs=icabnvfcbsHVTU9nAlXQRw%3D%3D; Package: SMD 4pin OSC; Value: 8MHz; Supplier 1: Mouser; Supplier Part Number 1: 815-ABM3B8000MHZD2T

## Sheet POWER.SchDoc
size A3; SheetNumber: 4; SheetTotal: 8
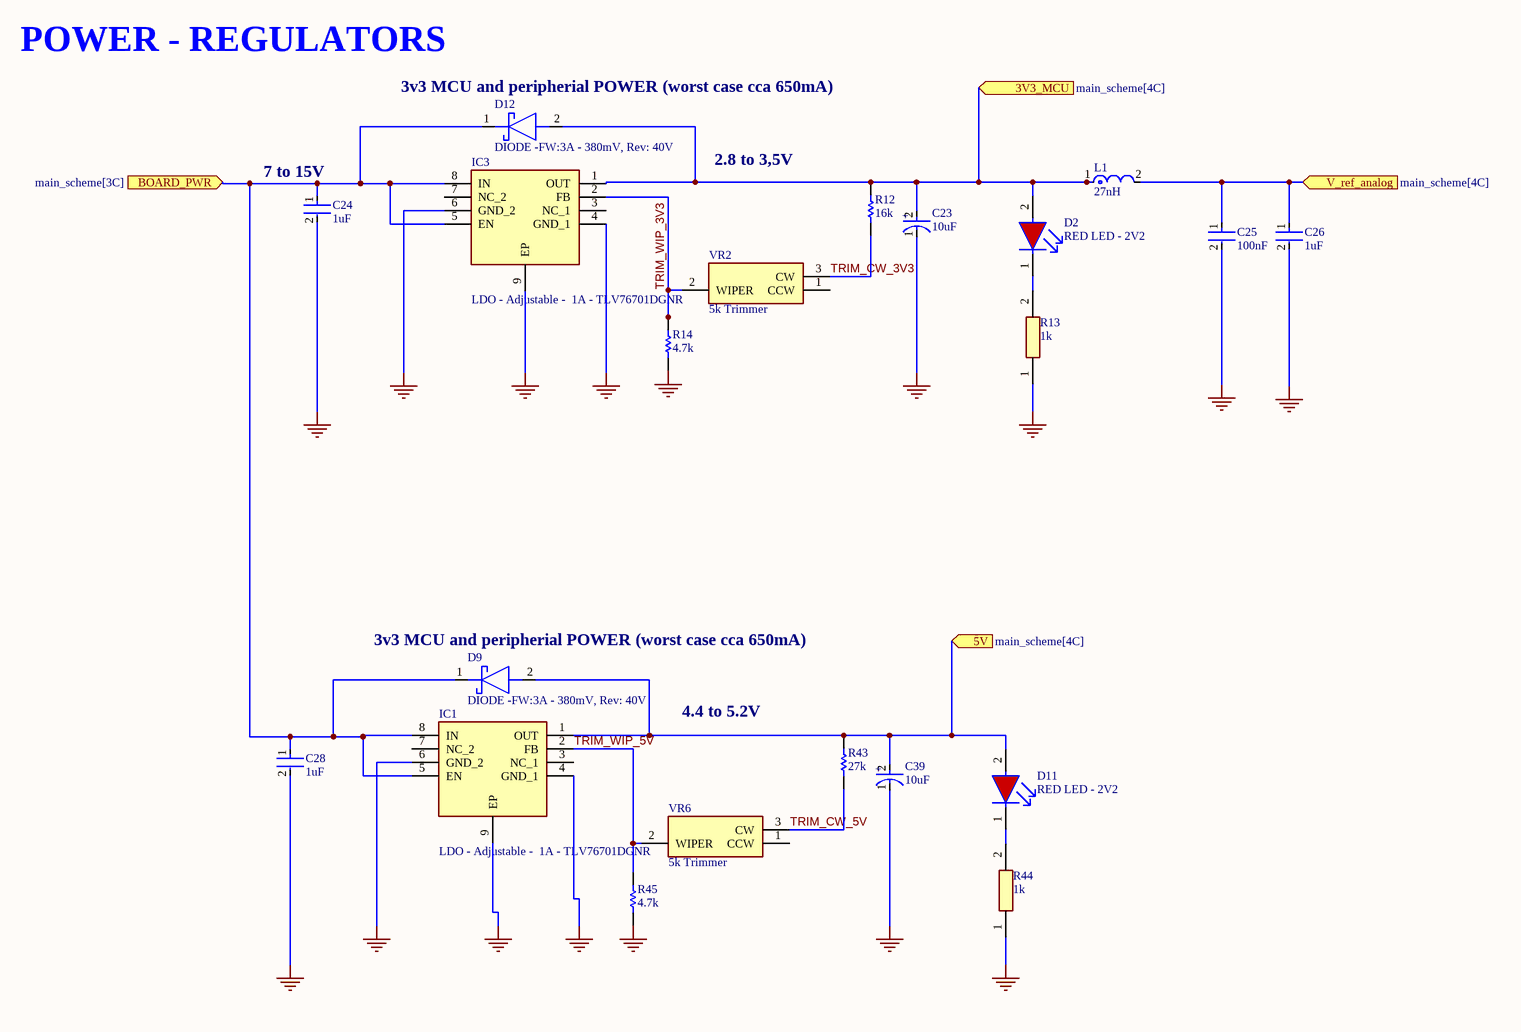
[diagram p4: POWER.SchDoc]

### Parts
C23  10uF  [0603_tantal]
C24  1uF  [0603-CAP]
C25  100nF  [0402 CAP]
C26  1uF  [0603-CAP]
C28  1uF  [0603-CAP]
C39  10uF  [0603_tantal]
D2  RED LED - 2V2  [0603_RED_LED]
D9  DIODE -FW:3A - 380mV, Rev: 40V  [DIONM5127X229N]
D11  RED LED - 2V2  [0603_RED_LED]
D12  DIODE -FW:3A - 380mV, Rev: 40V  [DIONM5127X229N]
IC1  LDO - Adjustable -  1A - TLV76701DGNR  [SOP65P490X110-9N]
IC3  LDO - Adjustable -  1A - TLV76701DGNR  [SOP65P490X110-9N]
L1  27nH  [0603-INDUCT]
R12  16k  [RESC1005X40X25NL05T05]
R13  1k  [0603- SMD resistor]
R14  4.7k  [RESC1005X40X25NL05T05]
R43  27k  [RESC1005X40X25NL05T05]
R44  1k  [0603- SMD resistor]
R45  4.7k  [RESC1005X40X25NL05T05]
VR2  5k Trimmer  [TC33X2503E]
VR6  5k Trimmer  [TC33X2503E]

### Ports
3V3_MCU (in, see main_scheme[4C]), 5V (in, see main_scheme[4C]), BOARD_PWR (in, see main_scheme[3C]), V_ref_analog (in, see main_scheme[4C])

### Nets
3V3_MCU: C23.2(A) D2.2(A) D12.2(A) IC3.1(OUT) L1.1 R12.1 ; port 3V3_MCU
5V: C39.2(A) D9.2(A) D11.2(A) IC1.1(OUT) R43.1 ; port 5V
BOARD_PWR: C24.1 C28.1 D9.1(K) D12.1(K) IC1.5(EN) IC1.8(IN) IC3.5(EN) IC3.8(IN) ; port BOARD_PWR
GND: C23.1(C) C24.2 C25.2 C26.2 C28.2 C39.1(C) IC1.4(GND_1) IC1.6(GND_2) IC1.9(EP) IC3.4(GND_1) IC3.6(GND_2) IC3.9(EP) R13.1 R14.2 R44.1 R45.2
TRIM_CW_3V3: R12.2 VR2.3(CW)
TRIM_CW_5V: R43.2 VR6.3(CW)
TRIM_WIP_3V3: IC3.2(FB) R14.1 VR2.2(WIPER)
TRIM_WIP_5V: IC1.2(FB) R45.1 VR6.2(WIPER)
V_ref_analog: C25.1 C26.1 L1.2 ; port V_ref_analog
NetD2_1: D2.1(C) R13.2
NetD11_1: D11.1(C) R44.2

Not connected (* = marked no-connect by the designer): IC1 3(NC_1) 7(NC_2); IC3 3(NC_1) 7(NC_2); VR2 1(CCW); VR6 1(CCW)

### Notes on the sheet
- POWER - REGULATORS
- (near D12) 3v3 MCU and peripherial POWER (worst case cca 650mA)
- 2.8 to 3,5V
- (near C24) 7 to 15V
- (near D9) 3v3 MCU and peripherial POWER (worst case cca 650mA)
- 4.4 to 5.2V
- (in symbol CAP 0603 Tantal -10uF) +

### Library data of the parts
C23 C39 = CAP 0603 Tantal -10uF: CAP TANT POLY 10UF 10V 0603 20%; PartNumber: F381A106MMAAH1; Package: 0603; Value: 10uF; ComponentLink1Description: myLinks; ComponentLink1URL: https://cz.mouser.com/ProductDetail/KYOCERA-AVX/F381A106MMAAH1?qs=sGAEpiMZZMtZ1n0r9vR22Q2XOsfGOI9effSA9nDSSSNE17O0WlLegw%3D%3D; Supplier 1: Mouser; Supplier Part Number 1: 581-F381A106MMAAH1
C24 C26 C28 = CAP-0603-1uF: General Purpose Ceramic Capacitor, 0603,1uF,25V,10%; PartNumber: C1608X7R1E105K080AB; ComponentLink1Description: myLinks; ComponentLink1URL: https://cz.mouser.com/ProductDetail/TDK/C1608X7R1E105K080AB?qs=NRhsANhppD8okfR52aTdVA%3D%3D; Package: 0603; Value: 1uF; Supplier 1: Mouser; Supplier Part Number 1: 810-C1608X7R1E105K
C25 = CAP 0402 - 100nF: as C4 on sheet main_scheme; Value: 100nF; Package: 0402; Supplier 1: Mouser; Supplier Part Number 1: 80-C0402C104K3R; ComponentLink1Description: myLinks; ComponentLink1URL: https://eu.mouser.com/ProductDetail/KEMET/C0402C104K3RACTU?qs=YCcZ0GhAU2q7BaxZ%2FluQHA%3D%3D
D2 D11 = LED - 0603 - RED - 2V2: as D8 on sheet main_scheme; Package: 0602; ComponentLink1Description: myLinks; ComponentLink1URL: https://cz.mouser.com/ProductDetail/ROHM-Semiconductor/SML-D12U1WT86?qs=M3jcYzEJUdEySuGkbjHEtQ%3D%3D; Supplier 1: Mouser; Supplier Part Number 1: 755-SML-D12U1WT86
D9 D12 = DIODE -FW:3A - 380mV, Rev: 40V: as D4 on sheet main_scheme; ComponentLink1Description: New link; ComponentLink1URL: https://cz.mouser.com/ProductDetail/Vishay-General-Semiconductor/SSA34HE3_A-I?qs=asPD7ZL2j3VimMFbwwU%2FoA%3D%3D; Value: FW:3A - 380mV, Rev: 40V; Package: DO-214AC-2; Supplier 1: Mouser; Supplier Part Number 1: 78-SSA34HE3_A/I
IC1 IC3 = LDO - Adjustable -  1A - TLV76701DGNR: Adjustable  LDO - Input: min 2.5V,max 16V. Output: 0.8V  to 14.6V 1A; Value: Adjustable 1A LDO; ComponentLink1Description: myLinks; ComponentLink1URL: https://cz.mouser.com/ProductDetail/Texas-Instruments/TLV76701DGNR?qs=QNEnbhJQKvYlzprjZl22mQ%3D%3D; Package: HVSSOP-8; PartNumber: TLV76701DGNR; Supplier 1: Mouser; Supplier Part Number 1: 595-TLV76701DGNR
L1 = Induct - 0603 -27nH: Multilayer type RF Inductor 27nH ±5% 0.54Ω 500mA 0603; PartNumber: LQG18HN27NJ00D; ComponentLink1Description: myLinks; ComponentLink1URL: https://cz.mouser.com/ProductDetail/Murata-Electronics/LQG18HN27NJ00D?qs=Ak0FrV9sSEhd5kkENoxyIg%3D%3D; Value: 27nH; Package: 0603; Supplier 1: Mouser; Supplier Part Number 1: 81-LQG18HN27NJ00D
R12 = Resistor - 0402 - 16k: Resistor - 0402 -  16k - 1% - 100mW; PartNumber: ERJ-2RKF1602X; Value: 16k; Package: 0402; ComponentLink1Description: myLinks; ComponentLink1URL: https://cz.mouser.com/ProductDetail/Panasonic/ERJ-2RKF1602X?qs=MVjVSMjNRMp9pwpCSUWuGw%3D%3D; Supplier 1: Mouser; Supplier Part Number 1: 667-ERJ-2RKF1602X
R13 R44 = RESISTOR - 0603 - 1k: as R41 on sheet main_scheme; ComponentLink1Description: myLinks; ComponentLink1URL: https://cz.mouser.com/ProductDetail/YAGEO/RT0603FRE071KL?qs=8cPjvKtxWv68ZVEzoi6JxQ%3D%3D; Value: 1k; Package: 0603; Supplier 1: Mouser; Supplier Part Number 1: 603-RT0603FRE071KL
R14 R45 = Resistor - 0402 - 4.7k: Resistor - 0402 -  4.7k - 1% - 100mW; PartNumber: ERJ-2RKF4701X; Value: 4.7k; Package: 0402; ComponentLink1Description: myLinks; ComponentLink1URL: https://cz.mouser.com/ProductDetail/Panasonic/ERJ-2RKF4701X?qs=H7k1u0Mp9JQWpspavPhQZA%3D%3D; Supplier 1: Mouser; Supplier Part Number 1: 667-ERJ-2RKF4701X
R43 = Resistor - 0402 - 27k: Resistor - 0402 - 27k - 1% - 100mW; PartNumber: ERJ-H2RD2702X; Value: 27k; Package: 0402; ComponentLink1Description: myLinks; ComponentLink1URL: https://cz.mouser.com/ProductDetail/Panasonic/ERJ-H2RD2702X?qs=eP2BKZSCXI50Sdsvimutzw%3D%3D; Supplier 1: Mouser; Supplier Part Number 1: 667-ERJ-H2RD2702X
VR2 VR6 = TRIMMER - 5k -100mW: Variable Resistor Trimmer - 5k - 25% -100mW - single turn; PartNumber: TC33X-2-502E; Package: 3mm SMD TRIMPOT; Value: 5k; ComponentLink1Description: myLinks; ComponentLink1URL: https://cz.mouser.com/ProductDetail/Bourns/TC33X-2-502E?qs=r%252B5EJQndA0pTgyiJsDuA%252BA%3D%3D; Supplier 1: Mouser; Supplier Part Number 1: 652-TC33X-2-502E

## Sheet Ethernet.SchDoc
size A2; SheetNumber: 3; SheetTotal: 8
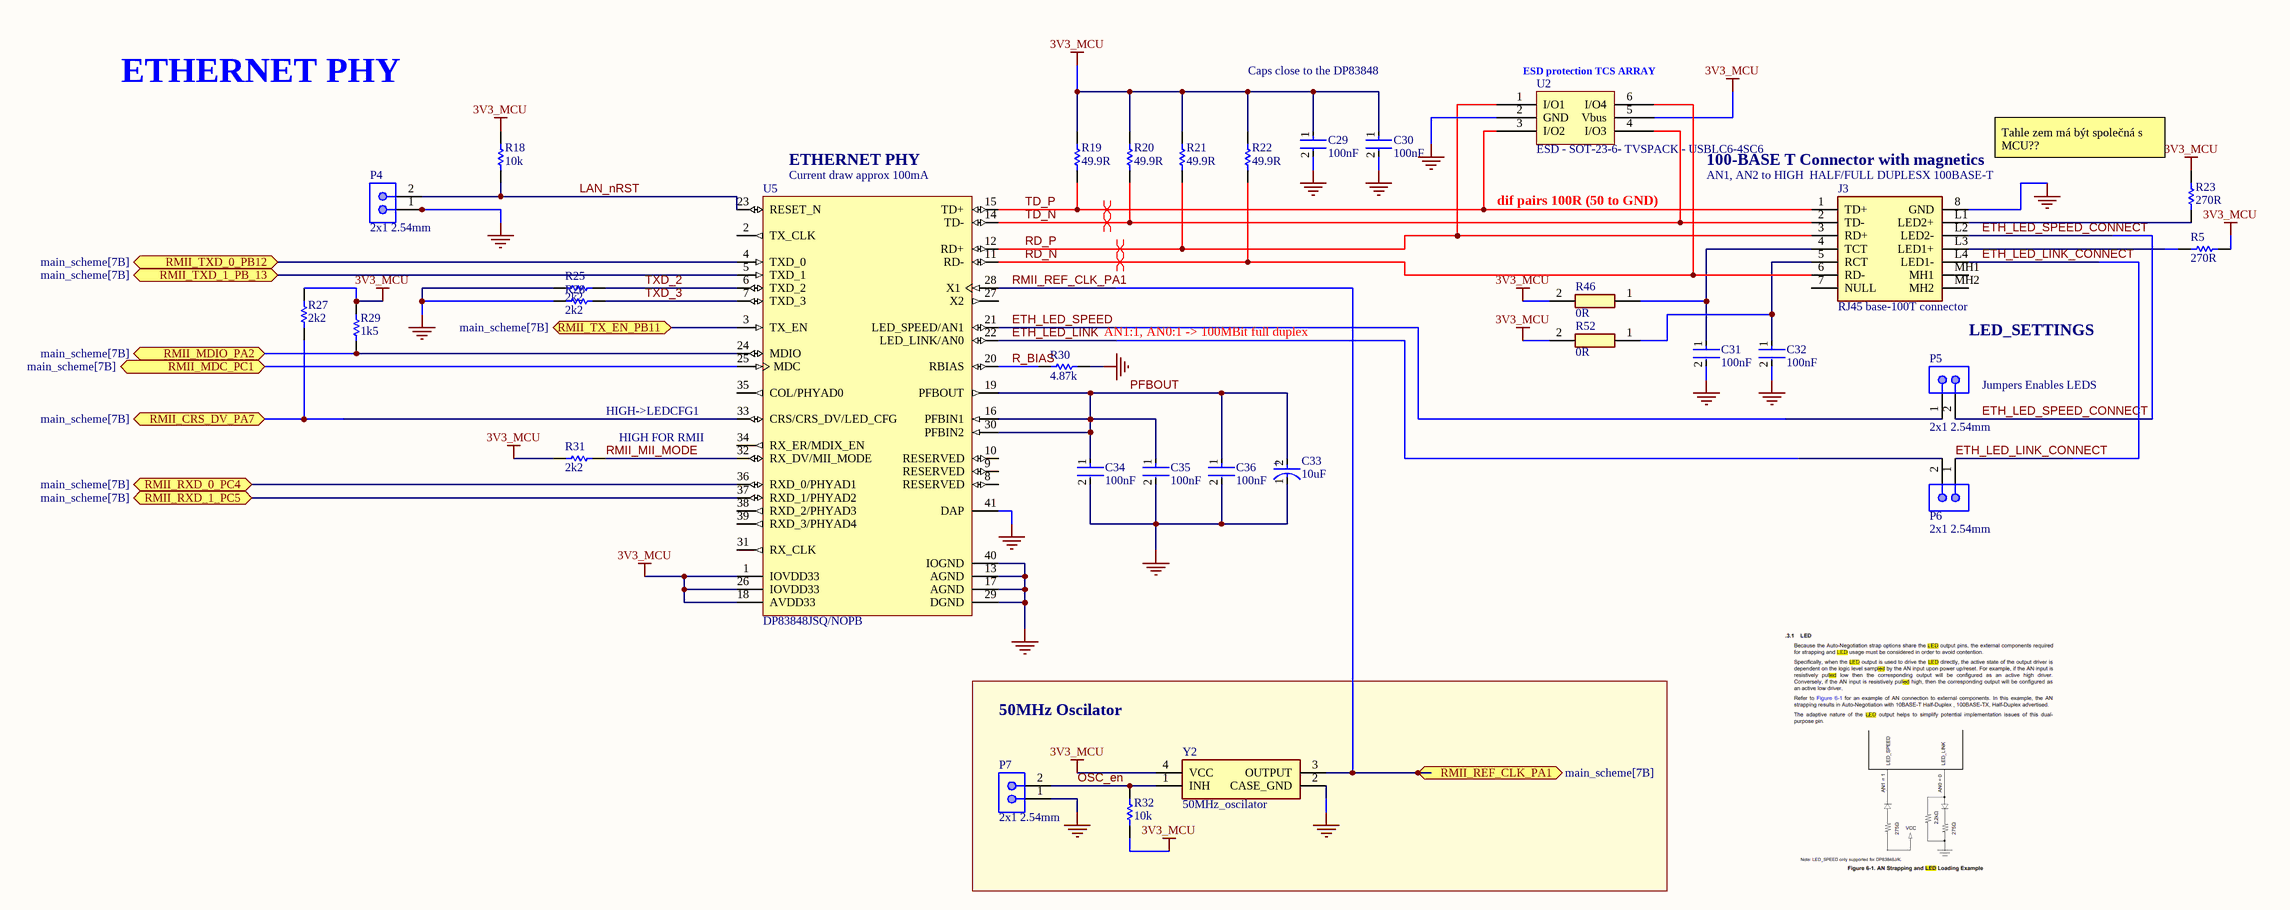
[diagram p5: Ethernet.SchDoc]

### Parts
C29  100nF  [0402 CAP]
C30  100nF  [0402 CAP]
C31  100nF  [0402 CAP]
C32  100nF  [0402 CAP]
C33  10uF  [0603_tantal]
C34  100nF  [0402 CAP]
C35  100nF  [0402 CAP]
C36  100nF  [0402 CAP]
J3  RJ45 base-100T connector  [ARJM11D7009ABEW2 - better3D]
P4  2x1 2.54mm  [2.54mm header 2x1]
P5  2x1 2.54mm  [2.54mm header 2x1]
P6  2x1 2.54mm  [2.54mm header 2x1]
P7  2x1 2.54mm  [2.54mm header 2x1]
R5  270R  [RESC1005X40X25NL05T05]
R18  10k  [RESC1005X40X25NL05T05]
R19  49.9R  [RESC1005X40X25NL05T05]
R20  49.9R  [RESC1005X40X25NL05T05]
R21  49.9R  [RESC1005X40X25NL05T05]
R22  49.9R  [RESC1005X40X25NL05T05]
R23  270R  [RESC1005X40X25NL05T05]
R25  2k2  [RESC1005X40X25NL05T05]
R27  2k2  [RESC1005X40X25NL05T05]
R28  2k2  [RESC1005X40X25NL05T05]
R29  1k5  [RESC1005X40X25NL05T05]
R30  4.87k  [RESC1005X40X25NL05T05]
R31  2k2  [RESC1005X40X25NL05T05]
R32  10k  [RESC1005X40X25NL05T05]
R46  0R  [0603- SMD resistor]
R52  0R  [0603- SMD resistor]
U2  ESD - SOT-23-6- TVSPACK - USBLC6-4SC6  [SOT95P280X145-6N]
U5  DP83848JSQ/NOPB  [RTA0040A_V]
Y2  50MHz_oscilator  [KC2016Z500000C15XXK]

### Blocks framed on the sheet
50MHz Oscilator: P7 R32 Y2

### Ports
RMII_CRS_DV_PA7 (bidir, see main_scheme[7B]), RMII_MDC_PC1 (bidir, see main_scheme[7B]), RMII_MDIO_PA2 (bidir, see main_scheme[7B]), RMII_REF_CLK_PA1 (bidir, see main_scheme[7B]), RMII_RXD_0_PC4 (bidir, see main_scheme[7B]), RMII_RXD_1_PC5 (bidir, see main_scheme[7B]), RMII_TX_EN_PB11 (bidir, see main_scheme[7B]), RMII_TXD_0_PB12 (bidir, see main_scheme[7B]), RMII_TXD_1_PB_13 (bidir, see main_scheme[7B])

### Nets
3V3_MCU: C29.1 C30.1 R5.1 R18.1 R19.1 R20.1 R21.1 R22.1 R23.1 R27.1 R29.1 R31.1 R32.2 R46.2 R52.2 U2.5(Vbus) U5.1(IOVDD33) U5.18(AVDD33) U5.26(IOVDD33) Y2.4(VCC)
GND: C29.2 C30.2 C31.2 C32.2 C33.1(C) C34.2 C35.2 C36.2 J3.8(GND) P4.1 P7.1 R25.2 R28.2 R30.1 U2.2(GND) U5.13(AGND) U5.17(AGND) U5.29(DGND) U5.40(IOGND) U5.41(DAP) Y2.2(CASE_GND)
ETH_LED_LINK: P6.2 U5.22(LED_LINK/AN0)
ETH_LED_LINK_CONNECT: J3.L4(LED1-) P6.1
ETH_LED_SPEED: P5.1 U5.21(LED_SPEED/AN1)
ETH_LED_SPEED_CONNECT: J3.L2(LED2-) P5.2
LAN_nRST: P4.2 R18.2 U5.23(RESET_N)
OSC_en: P7.2 R32.1 Y2.1(INH)
PFBOUT: C33.2(A) C34.1 C35.1 C36.1 U5.16(PFBIN1) U5.19(PFBOUT) U5.30(PFBIN2)
R_BIAS: R30.2 U5.20(RBIAS)
RD_N: J3.6(RD-) R22.2 U2.6(I/O4) U5.11(RD-)
RD_P: J3.3(RD+) R21.2 U2.1(I/O1) U5.12(RD+)
RMII_CRS_DV_PA7: R27.2 U5.33(CRS/CRS_DV/LED_CFG) ; port RMII_CRS_DV_PA7
RMII_MDC_PC1: U5.25(MDC) ; port RMII_MDC_PC1
RMII_MDIO_PA2: R29.2 U5.24(MDIO) ; port RMII_MDIO_PA2
RMII_MII_MODE: R31.2 U5.32(RX_DV/MII_MODE)
RMII_REF_CLK_PA1: U5.28(X1) Y2.3(OUTPUT) ; port RMII_REF_CLK_PA1
RMII_RXD_0_PC4: U5.36(RXD_0/PHYAD1) ; port RMII_RXD_0_PC4
RMII_RXD_1_PC5: U5.37(RXD_1/PHYAD2) ; port RMII_RXD_1_PC5
RMII_TX_EN_PB11: U5.3(TX_EN) ; port RMII_TX_EN_PB11
RMII_TXD_0_PB12: U5.4(TXD_0) ; port RMII_TXD_0_PB12
RMII_TXD_1_PB_13: U5.5(TXD_1) ; port RMII_TXD_1_PB_13
TD_N: J3.2(TD-) R20.2 U2.4(I/O3) U5.14(TD-)
TD_P: J3.1(TD+) R19.2 U2.3(I/O2) U5.15(TD+)
TXD_2: R25.1 U5.6(TXD_2)
TXD_3: R28.1 U5.7(TXD_3)
NetC31_1: C31.1 J3.4(TCT) R46.1
NetC32_1: C32.1 J3.5(RCT) R52.1
NetJ3_L1: J3.L1(LED2+) R23.2
NetJ3_L3: J3.L3(LED1+) R5.2

Not connected (* = marked no-connect by the designer): J3 7(NULL) MH1 MH2; U5 2(TX_CLK) 8(RESERVED) 9(RESERVED) 10(RESERVED) 27(X2) 31(RX_CLK) 34(RX_ER/MDIX_EN) 35(COL/PHYAD0) 38(RXD_2/PHYAD3) 39(RXD_3/PHYAD4)

### Layout directives
differential pair; differential pair class ETH_RD_DIFF: RD_N, RD_P
differential pair; differential pair class ETH_TD_DIFF: TD_N, TD_P

### Notes on the sheet
- ETHERNET PHY
- Caps close to the DP83848
- (near U2) ESD protection TCS ARRAY
- (near U5) Current draw approx 100mA
- (near U5) ETHERNET PHY
- (near J3) AN1, AN2 to HIGH  HALF/FULL DUPLESX 100BASE-T
- (near J3) 100-BASE T Connector with magnetics
- (near R23) Tahle zem má být společná s MCU??
- dif pairs 100R (50 to GND)
- (near R30) AN1:1, AN0:1 -> 100MBit full duplex
- LED_SETTINGS
- (near P5) Jumpers Enables LEDS
- (near R31) HIGH->LEDCFG1
- (near R31) HIGH FOR RMII
- (in symbol CAP 0603 Tantal -10uF) +

### Library data of the parts
C29-C32 C34-C36 = CAP 0402 - 100nF: as C4 on sheet main_scheme; Value: 100nF; Package: 0402; Supplier 1: Mouser; Supplier Part Number 1: 80-C0402C104K3R; ComponentLink1Description: myLinks; ComponentLink1URL: https://eu.mouser.com/ProductDetail/KEMET/C0402C104K3RACTU?qs=YCcZ0GhAU2q7BaxZ%2FluQHA%3D%3D
C33 = CAP 0603 Tantal -10uF: as C23 on sheet POWER; Package: 0603; Value: 10uF; ComponentLink1Description: myLinks; ComponentLink1URL: https://cz.mouser.com/ProductDetail/KYOCERA-AVX/F381A106MMAAH1?qs=sGAEpiMZZMtZ1n0r9vR22Q2XOsfGOI9effSA9nDSSSNE17O0WlLegw%3D%3D; Supplier 1: Mouser; Supplier Part Number 1: 581-F381A106MMAAH1
J3 = RJ45 base-100T connector: Connector RJ45 base-100T CAT5/6, with magnetics inside; PartNumber: ARJM11D7-009-AB-EW2; Value: 100BASE-T with magnetics; ComponentLink1Description: myLinks; ComponentLink1URL: https://cz.mouser.com/ProductDetail/ABRACON/ARJM11D7-009-AB-EW2?qs=YCa%2FAAYMW01wgGAVSiGYdQ%3D%3D; Package: RJ45 with magnetics; Supplier 1: Mouser; Supplier Part Number 1: 815-RJM11D7009ABEW2
P4-P7 = Header - 2x1 2.54mm: as P3 on sheet main_scheme; ComponentLink1Description: myLinks; ComponentLink1URL: https://cz.mouser.com/ProductDetail/TE-Connectivity/5-146280-2?qs=bwpFY26eRVcxHP%252BQexhLNQ%3D%3D; Value: 2x1 2.54mm; Package: 2x1 2.54mm; Supplier 1: Mouser; Supplier Part Number 1: 571-5-146280-2
R5 R23 = Resistor - 0402 -270R: Resistor - 0402 - 270R - 1% - 125mW; PartNumber: CRGP0402F270R; Value: 270R; Package: 0402; ComponentLink1Description: myLinks; ComponentLink1URL: https://cz.mouser.com/ProductDetail/TE-Connectivity-Holsworthy/CRGP0402F270R?qs=wUXugUrL1qyX8E%252BNg7WV%252Bg%3D%3D; Supplier 1: Mouser; Supplier Part Number 1: 279-CRGP0402F270R
R18 R32 = Resistor - 0402 -10k: as R1 on sheet main_scheme; Value: 10k; Package: 0402; ComponentLink1Description: myLinks; ComponentLink1URL: https://cz.mouser.com/ProductDetail/YAGEO/RC0402JR-7W10KL?qs=tggtontpCXPnY%2FhgQXv%2FLg%3D%3D; Supplier 1: Mouser; Supplier Part Number 1: 603-RC0402JR-7W10KL
R19-R22 = Resistor - 0402 - 49.9R: Resistor - 0402 -  49.9R - 1% - 100mW; PartNumber: ERJ-2RKF49R9X; Value: 49.9R; Package: 0402; ComponentLink1Description: myLinks; ComponentLink1URL: https://cz.mouser.com/ProductDetail/Panasonic/ERJ-2RKF49R9X?qs=sGAEpiMZZMtG0KNrPCHnjWXb3yLuGJ27UdsBFBOB8ls%3D; Supplier 1: Mouser; Supplier Part Number 1: 667-ERJ-2RKF49R9X
R25 R27 R28 R31 = Resistor - 0402 - 2k2: Resistor - 0402 - 2k2 - 1% - 200mW; PartNumber: ERJ-PA2F2201X; Value: 2k2; Package: 0402; ComponentLink1Description: myLinks; ComponentLink1URL: https://cz.mouser.com/ProductDetail/Panasonic/ERJ-PA2F2201X?qs=sGAEpiMZZMtG0KNrPCHnjZ6x%2FURjllozzwNvbZVeFeMwGqzVywslMw%3D%3D; Supplier 1: Mouser; Supplier Part Number 1: 667-ERJ-PA2F2201X
R29 = Resistor - 0402 - 1k5: Resistor - 0402 - 1k5 - 1% - 100mW; PartNumber: ERJ2RKF6800X; Value: 1k5; Package: 0402; ComponentLink1Description: myLinks; ComponentLink1URL: https://cz.mouser.com/ProductDetail/Panasonic/ERJ-2RKF1501X?qs=sGAEpiMZZMtG0KNrPCHnjTg0x5DoQJ5PTwSSYoQ29R0%3D; Supplier 1: Mouser; Supplier Part Number 1: 667-ERJ-2RKF6800X
R30 = Resistor - 0402 - 4.87k: as R36 on sheet main_scheme; Value: 4.87k; Package: 0402; ComponentLink1Description: myLinks; ComponentLink1URL: https://cz.mouser.com/ProductDetail/Panasonic/ERJ-2RKF4871X?qs=YMBIwoNQYdV9ZzOLxQ6NUw%3D%3D; Supplier 1: Mouser; Supplier Part Number 1: 667-ERJ-2RKF4871X
R46 R52 = RESISTOR - 0603 - 0R: as R47 on sheet main_scheme; ComponentLink1Description: myLinks; ComponentLink1URL: https://cz.mouser.com/ProductDetail/Panasonic/ERJ-3GEY0R00V?qs=66DK8nO8gJALIOqOWgiVwg%3D%3D; Value: 0R; Package: 0603; Supplier 1: Mouser; Supplier Part Number 1: 667-ERJ-3GEY0R00V
U2 = ESD - SOT-23-6- TVSPACK - USBLC6-4SC6: ESD Suppressors / TVS Diodes Low Cap ESD Protect -  Working VOltage 5.25V, Br: 6V, Clamp 17V; Value: Operate:5.25V, Br: 6V, Clamp 17V; Package: SOT-23-6; PartNumber: USBLC6-4SC6; ComponentLink1Description: myLinks; ComponentLink1URL: https://cz.mouser.com/ProductDetail/STMicroelectronics/USBLC6-4SC6?qs=k9dH%2Fx4GHJCNdehb8zInZg%3D%3D; Supplier 1: Mouser; Supplier Part Number 1: 511-USBLC6-4SC6
U5 = LAN-DP83848JSQ/NOPB: PHYTER® Mini LS Commercial Temperature Single Port 10/100 Mb/s Ethernet Transceiver, 40-pin LLP, Pb-Free, 250 Reel; Value: 10/100BASE-T PHY; ComponentLink1URL: https://cz.mouser.com/ProductDetail/Texas-Instruments/DP83848JSQ-NOPB?qs=7X5t%252BdzoRHAkvw41SeKPjQ%3D%3D; PartNumber: DP83848JSQ/NOPB; ComponentLink1Description: myLinks; Package: WQFN-40; Supplier 1: Mouser; Supplier Part Number 1: 926-DP83848JSQ/NOPB
Y2 = 50MHz_oscilator: Oscilator - 50MHz - 30ppm - 15pF - 1.71 - 3.63V; PartNumber: KC2016Z50.0000C15XXK; ComponentLink1Description: myLinks; ComponentLink1URL: https://cz.mouser.com/ProductDetail/KYOCERA-AVX/KC2016Z50.0000C15XXK?qs=sGAEpiMZZMtldj7qu1ydrbV2KlGvrVWI6qQFSeMxWJ%252BAw5U4y9rW5g%3D%3D; Value: 50MHz; Package: 2x1.6mm; Supplier 1: Mouser; Supplier Part Number 1: 346-KC2016Z50.0000C1

## Sheet USB.SchDoc
size A3; SheetNumber: 8; SheetTotal: 8
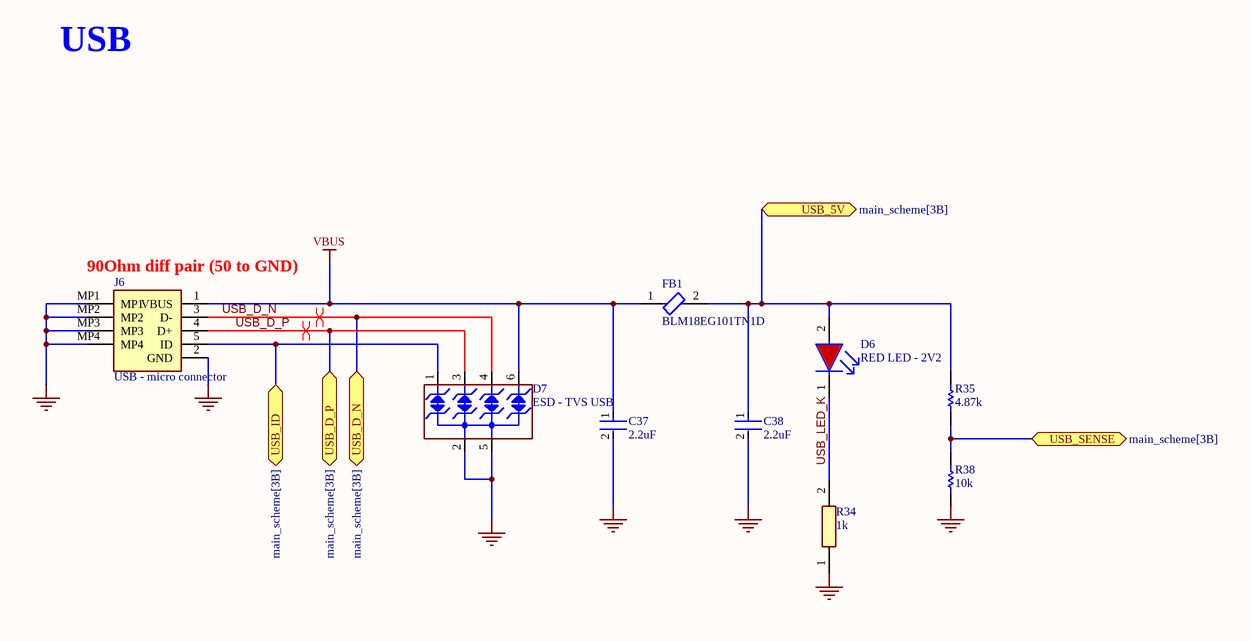
[diagram p6: USB.SchDoc]

### Parts
C37  2.2uF  [0603-CAP]
C38  2.2uF  [0603-CAP]
D6  RED LED - 2V2  [0603_RED_LED]
D7  ESD - TVS USB  [SOT23-6L]
FB1  BLM18EG101TN1D  [Ferrite_bead]
J6  USB - micro connector  [USB_micro]
R34  1k  [0603- SMD resistor]
R35  4.87k  [RESC1005X40X25NL05T05]
R38  10k  [RESC1005X40X25NL05T05]

### Ports
USB_5V (bidir, see main_scheme[3B]), USB_D_N (bidir, see main_scheme[3B]), USB_D_P (bidir, see main_scheme[3B]), USB_ID (bidir, see main_scheme[3B]), USB_SENSE (bidir, see main_scheme[3B])

### Nets
GND: C37.2 C38.2 D7.2(IO2) D7.5(IO4) J6.2(GND) J6.MP1 J6.MP2 J6.MP3 J6.MP4 R34.1 R38.2
VBUS: C37.1 D7.6(NC) FB1.1 J6.1(VBUS)
USB_5V: C38.1 D6.2(A) FB1.2 R35.1 ; port USB_5V
USB_D_N: D7.4(IO3) J6.3(D-) ; port USB_D_N
USB_D_P: D7.3(GND) J6.4(D+) ; port USB_D_P
USB_ID: D7.1(IO1) J6.5(ID) ; port USB_ID
USB_LED_K: D6.1(C) R34.2
USB_SENSE: R35.2 R38.1 ; port USB_SENSE

### Layout directives
differential pair; differential pair class USB_DIFF: USB_D_N, USB_D_P

### Notes on the sheet
- USB
- (near J6) 90Ohm diff pair (50 to GND)

### Library data of the parts
C37 C38 = CAP-0603-2.2uF: as C16 on sheet main_scheme; ComponentLink1Description: myLinks; ComponentLink1URL: https://cz.mouser.com/ProductDetail/TDK/C1608JB1V225K080AC?qs=xLDY6iXSiQbY%2FrhN9AA4AA%3D%3D; Package: 0603; Value: 2.2uF
D6 = LED - 0603 - RED - 2V2: as D8 on sheet main_scheme; Package: 0602; ComponentLink1Description: myLinks; ComponentLink1URL: https://cz.mouser.com/ProductDetail/ROHM-Semiconductor/SML-D12U1WT86?qs=M3jcYzEJUdEySuGkbjHEtQ%3D%3D
D7 = ESD - TVS USB: 4-line ESD protection; PartNumber: ESDA6V1BC6; Value: ESD for 5V USB rails; Package: SOT-23-6; ComponentLink1Description: myLinks; ComponentLink1URL: https://cz.mouser.com/ProductDetail/STMicroelectronics/ESDA6V1BC6?qs=9PdvrqCL7oAFp2zmpu55Tw%3D%3D
FB1 = Ferrite_bead - 0603 - 100R: Chip Ferrite Bead, 0603, 100Ω @ 100MHz, 25%, 0.045Ω, 2A; Value: 100R; Package: 0603; PartNumber: BLM18EG101TN1D; ComponentLink1Description: myLinks; ComponentLink1URL: https://www.mouser.co.uk/ProductDetail/Murata-Electronics/BLM18EG101TN1D?qs=rjbY5pkpCp4yQ17nVbKqBw%3D%3D
J6 = USB-micro connector: USB Connectors USB jack, 2.0, micro B type, 5 pin, horizontal, gold flash, SMT, TRConnector; PartNumber: UJ2-MIBH-G-SMT-TR; Value: USB 2.0 Type B; ComponentLink1Description: myLinks; ComponentLink1URL: https://cz.mouser.com/ProductDetail/CUI-Devices/UJ2-MIBH-G-SMT-TR?qs=IS%252B4QmGtzzpvS1XQusp0iA%3D%3D; Package: USB 2.0 Type B
R34 = RESISTOR - 0603 - 1k: as R41 on sheet main_scheme; ComponentLink1Description: myLinks; ComponentLink1URL: https://cz.mouser.com/ProductDetail/YAGEO/RT0603FRE071KL?qs=8cPjvKtxWv68ZVEzoi6JxQ%3D%3D; Value: 1k; Package: 0603; Supplier 1: Mouser; Supplier Part Number 1: 603-RT0603FRE071KL
R35 = Resistor - 0402 - 4.87k: as R36 on sheet main_scheme; Value: 4.87k; Package: 0402; ComponentLink1Description: myLinks; ComponentLink1URL: https://cz.mouser.com/ProductDetail/Panasonic/ERJ-2RKF4871X?qs=YMBIwoNQYdV9ZzOLxQ6NUw%3D%3D
R38 = Resistor - 0402 -10k: as R1 on sheet main_scheme; Value: 10k; Package: 0402; ComponentLink1Description: myLinks; ComponentLink1URL: https://cz.mouser.com/ProductDetail/YAGEO/RC0402JR-7W10KL?qs=tggtontpCXPnY%2FhgQXv%2FLg%3D%3D

## Sheet Opto_inputs.SchDoc
size A4; SheetNumber: 2; SheetTotal: 8
Used 8 times, as channels U_Opto_inputs, U_Opto_inputs, U_Opto_inputs, U_Opto_inputs, U_Opto_inputs, U_Opto_inputs, U_Opto_inputs, U_Opto_inputs. Parts and nets are listed once, with the designators drawn on the sheet.
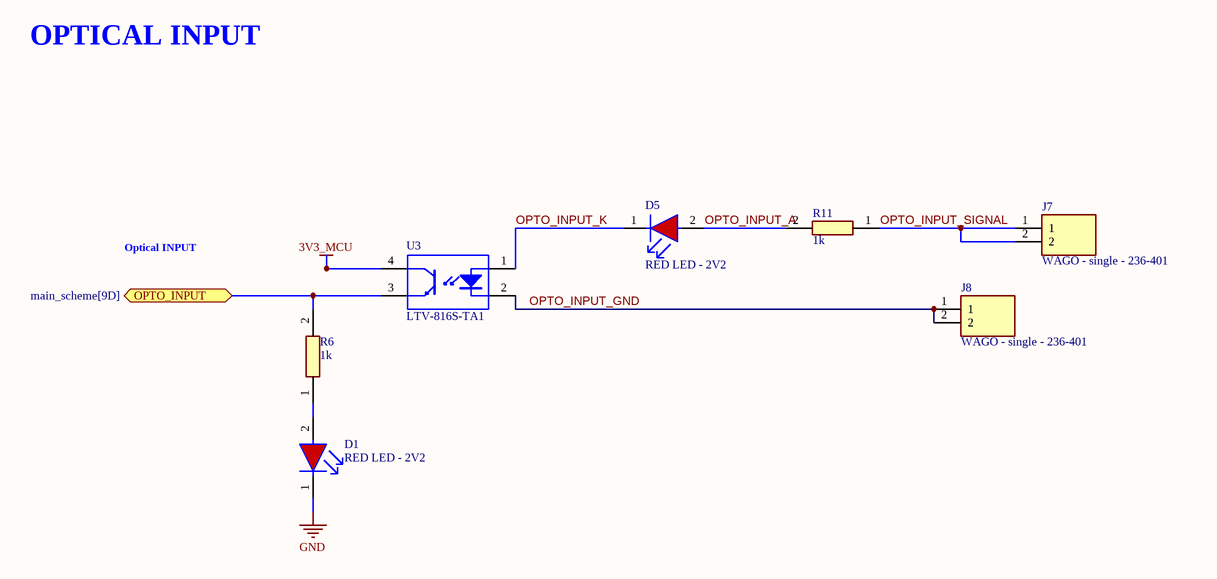
[diagram p7: Opto_inputs.SchDoc]

### Parts
D1  RED LED - 2V2  [0603_RED_LED]
D5  RED LED - 2V2  [0603_RED_LED]
J7  WAGO - single - 236-401  [WAGO-236-601]
J8  WAGO - single - 236-401  [WAGO-236-601]
R6  1k  [0603- SMD resistor]
R11  1k  [0603- SMD resistor]
U3  LTV-816S-TA1  [LTST-LTV-816S_V]

### Ports
OPTO_INPUT (bidir, see main_scheme[9D])

### Nets
3V3_MCU: U3.4(COLLECTOR)
GND: D1.1(C)
OPTO_INPUT: R6.2 U3.3(EMITTER) ; port OPTO_INPUT
OPTO_INPUT_A: D5.2(A) R11.2
OPTO_INPUT_GND: J8.1 J8.2 U3.2(CATHODE)
OPTO_INPUT_K: D5.1(C) U3.1(ANODE)
OPTO_INPUT_SIGNAL: J7.1 J7.2 R11.1
NetD1_2: D1.2(A) R6.1

### Channels
U_Opto_inputs: designators end in _U_Opto_inputs#1; ports OPTO_INPUT=NetR6_U_Opto_inputs#1_2
U_Opto_inputs: designators end in _U_Opto_inputs#2; ports OPTO_INPUT=NetR6_U_Opto_inputs#2_2
U_Opto_inputs: designators end in _U_Opto_inputs#3; ports OPTO_INPUT=NetR6_U_Opto_inputs#3_2
U_Opto_inputs: designators end in _U_Opto_inputs#4; ports OPTO_INPUT=NetR6_U_Opto_inputs#4_2
U_Opto_inputs: designators end in _U_Opto_inputs#5; ports OPTO_INPUT=NetR6_U_Opto_inputs#5_2
U_Opto_inputs: designators end in _U_Opto_inputs#6; ports OPTO_INPUT=NetR6_U_Opto_inputs#6_2
U_Opto_inputs: designators end in _U_Opto_inputs#7; ports OPTO_INPUT=NetR6_U_Opto_inputs#7_2
U_Opto_inputs: designators end in _U_Opto_inputs#8; ports OPTO_INPUT=NetR6_U_Opto_inputs#8_2

### Notes on the sheet
- OPTICAL INPUT
- Optical INPUT

### Library data of the parts
D1 D5 = LED - 0603 - RED - 2V2: as D8 on sheet main_scheme; Package: 0602; ComponentLink1Description: myLinks; ComponentLink1URL: https://cz.mouser.com/ProductDetail/ROHM-Semiconductor/SML-D12U1WT86?qs=M3jcYzEJUdEySuGkbjHEtQ%3D%3D; Supplier 1: Mouser; Supplier Part Number 1: 755-SML-D12U1WT86
J7 J8 = WAGO - single - 236-401: as J4 on sheet main_scheme; ComponentLink1Description: myLinks; ComponentLink1URL: https://cz.farnell.com/wago/236-401/terminal-block-wire-to-brd-1pos/dp/1891620?gclid=CjwKCAiAu5agBhBzEiwAdiR5tFj9uwuLgrlShO914YuSUEtsU0o4Hiox7ZjRnpSnFBbtyRYLbKYJWxoC0xgQAvD_BwE&mckv=sEoohdYPd_dc|pcrid|263733373421|kword|+wago%20+236-401|match|b|plid||slid||product||pgrid|56870816529|ptaid|kwd-298399736559|&CMP=KNC-GCZ-GEN-SKU-MDC; Value: 24A 320V; Package: 236-401; PartNumber: 236-401; Supplier 1: Farnell; Supplier Part Number 1: 1891620
R6 R11 = RESISTOR - 0603 - 1k: as R41 on sheet main_scheme; ComponentLink1Description: myLinks; ComponentLink1URL: https://cz.mouser.com/ProductDetail/YAGEO/RT0603FRE071KL?qs=8cPjvKtxWv68ZVEzoi6JxQ%3D%3D; Value: 1k; Package: 0603; Supplier 1: Mouser; Supplier Part Number 1: 603-RT0603FRE071KL
U3 = OPTO - 50mA - 80V: Photocoupler, 50 mA, -30 to 110 degC, 4-Pin SMD, RoHS, Tape and Reel; Value: output 80V 50mA, Input  1.2V; ComponentLink1Description: myLinks; ComponentLink1URL: https://cz.mouser.com/ProductDetail/Lite-On/LTV-816S-TA1?qs=gnaPJ2cis715Sm%2FgFsy6%2FQ%3D%3D; PartNumber: LTV-816S-TA1; Package: PDIP-4 Gull Wing; Supplier 1: Mouser; Supplier Part Number 1: 859-LTV-816S-TA1

## Sheet PORTS_DRIVER.SchDoc
size A4; SheetNumber: 7; SheetTotal: 8
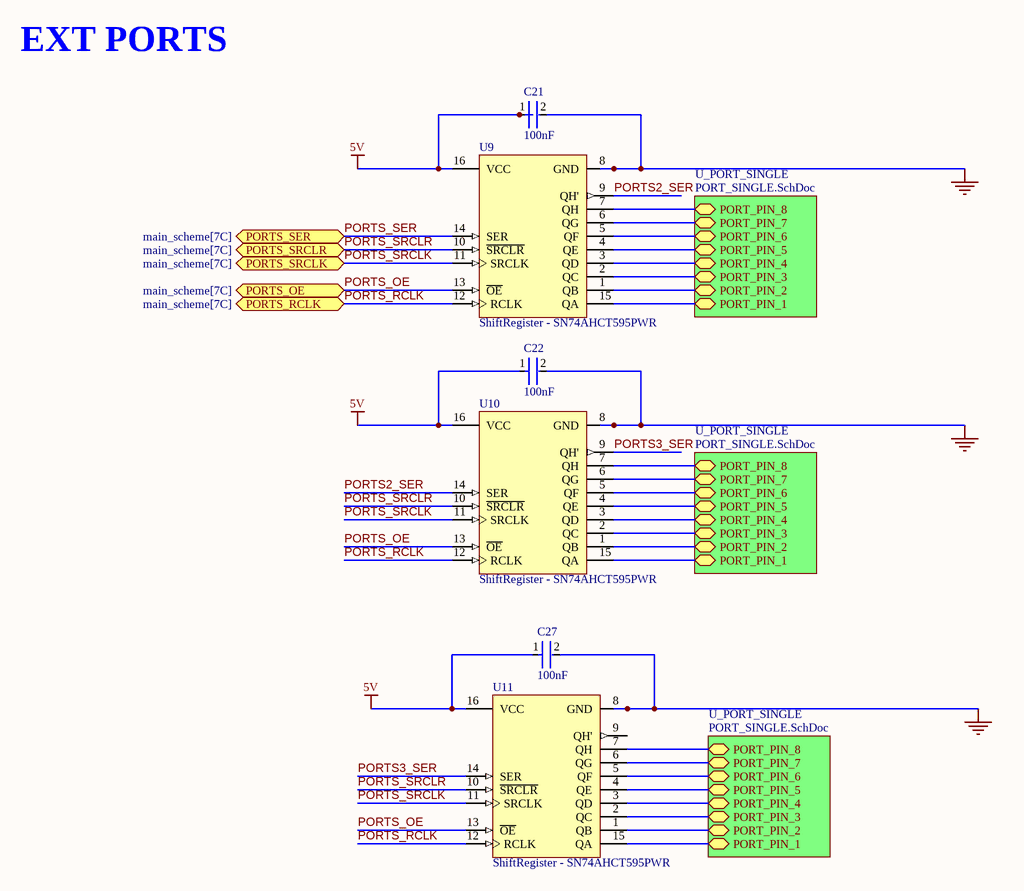
[diagram p8: PORTS_DRIVER.SchDoc]

### Parts
C21  100nF  [0402 CAP]
C22  100nF  [0402 CAP]
C27  100nF  [0402 CAP]
U9  ShiftRegister - SN74AHCT595PWR  [SSOT16]
U10  ShiftRegister - SN74AHCT595PWR  [SSOT16]
U11  ShiftRegister - SN74AHCT595PWR  [SSOT16]

### Sub-sheets
U_PORT_SINGLE = PORT_SINGLE.SchDoc: PORT_PIN_1 (bidir), PORT_PIN_2 (bidir), PORT_PIN_3 (bidir), PORT_PIN_4 (bidir), PORT_PIN_5 (bidir), PORT_PIN_6 (bidir), PORT_PIN_7 (bidir), PORT_PIN_8 (bidir)
U_PORT_SINGLE = PORT_SINGLE.SchDoc: PORT_PIN_1 (bidir), PORT_PIN_2 (bidir), PORT_PIN_3 (bidir), PORT_PIN_4 (bidir), PORT_PIN_5 (bidir), PORT_PIN_6 (bidir), PORT_PIN_7 (bidir), PORT_PIN_8 (bidir)
U_PORT_SINGLE = PORT_SINGLE.SchDoc: PORT_PIN_1 (bidir), PORT_PIN_2 (bidir), PORT_PIN_3 (bidir), PORT_PIN_4 (bidir), PORT_PIN_5 (bidir), PORT_PIN_6 (bidir), PORT_PIN_7 (bidir), PORT_PIN_8 (bidir)

### Ports
PORTS_OE (bidir, see main_scheme[7C]), PORTS_RCLK (bidir, see main_scheme[7C]), PORTS_SER (bidir, see main_scheme[7C]), PORTS_SRCLK (bidir, see main_scheme[7C]), PORTS_SRCLR (bidir, see main_scheme[7C])

### Nets
5V: C21.1 C22.1 C27.1 U9.16(VCC) U10.16(VCC) U11.16(VCC)
GND: C21.2 C22.2 C27.2 U9.8(GND) U10.8(GND) U11.8(GND)
PORTS2_SER: U9.9(QH') U10.14(SER)
PORTS3_SER: U10.9(QH') U11.14(SER)
PORTS_OE: U9.13(~{OE}) U10.13(~{OE}) U11.13(~{OE}) ; port PORTS_OE
PORTS_RCLK: U9.12(RCLK) U10.12(RCLK) U11.12(RCLK) ; port PORTS_RCLK
PORTS_SER: U9.14(SER) ; port PORTS_SER
PORTS_SRCLK: U9.11(SRCLK) U10.11(SRCLK) U11.11(SRCLK) ; port PORTS_SRCLK
PORTS_SRCLR: U9.10(~{SRCLR}) U10.10(~{SRCLR}) U11.10(~{SRCLR}) ; port PORTS_SRCLR
NetR15_U_PORTS_DRIVER_U_PORT_SINGLE#1_2: U9.15(QA) ; sheet U_PORT_SINGLE/PORT_PIN_1
NetR15_U_PORTS_DRIVER_U_PORT_SINGLE#2_2: U10.15(QA) ; sheet U_PORT_SINGLE/PORT_PIN_1
NetR15_U_PORTS_DRIVER_U_PORT_SINGLE#3_2: U11.15(QA) ; sheet U_PORT_SINGLE/PORT_PIN_1
NetR16_U_PORTS_DRIVER_U_PORT_SINGLE#1_1: U9.1(QB) ; sheet U_PORT_SINGLE/PORT_PIN_2
NetR16_U_PORTS_DRIVER_U_PORT_SINGLE#2_1: U10.1(QB) ; sheet U_PORT_SINGLE/PORT_PIN_2
NetR16_U_PORTS_DRIVER_U_PORT_SINGLE#3_1: U11.1(QB) ; sheet U_PORT_SINGLE/PORT_PIN_2
NetR17_U_PORTS_DRIVER_U_PORT_SINGLE#1_2: U9.2(QC) ; sheet U_PORT_SINGLE/PORT_PIN_3
NetR17_U_PORTS_DRIVER_U_PORT_SINGLE#2_2: U10.2(QC) ; sheet U_PORT_SINGLE/PORT_PIN_3
NetR17_U_PORTS_DRIVER_U_PORT_SINGLE#3_2: U11.2(QC) ; sheet U_PORT_SINGLE/PORT_PIN_3
NetR24_U_PORTS_DRIVER_U_PORT_SINGLE#1_1: U9.3(QD) ; sheet U_PORT_SINGLE/PORT_PIN_4
NetR24_U_PORTS_DRIVER_U_PORT_SINGLE#2_1: U10.3(QD) ; sheet U_PORT_SINGLE/PORT_PIN_4
NetR24_U_PORTS_DRIVER_U_PORT_SINGLE#3_1: U11.3(QD) ; sheet U_PORT_SINGLE/PORT_PIN_4
NetR26_U_PORTS_DRIVER_U_PORT_SINGLE#1_2: U9.4(QE) ; sheet U_PORT_SINGLE/PORT_PIN_5
NetR26_U_PORTS_DRIVER_U_PORT_SINGLE#2_2: U10.4(QE) ; sheet U_PORT_SINGLE/PORT_PIN_5
NetR26_U_PORTS_DRIVER_U_PORT_SINGLE#3_2: U11.4(QE) ; sheet U_PORT_SINGLE/PORT_PIN_5
NetR37_U_PORTS_DRIVER_U_PORT_SINGLE#1_1: U9.5(QF) ; sheet U_PORT_SINGLE/PORT_PIN_6
NetR37_U_PORTS_DRIVER_U_PORT_SINGLE#2_1: U10.5(QF) ; sheet U_PORT_SINGLE/PORT_PIN_6
NetR37_U_PORTS_DRIVER_U_PORT_SINGLE#3_1: U11.5(QF) ; sheet U_PORT_SINGLE/PORT_PIN_6
NetR39_U_PORTS_DRIVER_U_PORT_SINGLE#1_2: U9.6(QG) ; sheet U_PORT_SINGLE/PORT_PIN_7
NetR39_U_PORTS_DRIVER_U_PORT_SINGLE#2_2: U10.6(QG) ; sheet U_PORT_SINGLE/PORT_PIN_7
NetR39_U_PORTS_DRIVER_U_PORT_SINGLE#3_2: U11.6(QG) ; sheet U_PORT_SINGLE/PORT_PIN_7
NetR40_U_PORTS_DRIVER_U_PORT_SINGLE#1_1: U9.7(QH) ; sheet U_PORT_SINGLE/PORT_PIN_8
NetR40_U_PORTS_DRIVER_U_PORT_SINGLE#2_1: U10.7(QH) ; sheet U_PORT_SINGLE/PORT_PIN_8
NetR40_U_PORTS_DRIVER_U_PORT_SINGLE#3_1: U11.7(QH) ; sheet U_PORT_SINGLE/PORT_PIN_8

Not connected (* = marked no-connect by the designer): U11 9(QH')

### Notes on the sheet
- EXT PORTS

### Library data of the parts
C21 C22 C27 = CAP 0402 - 100nF: as C4 on sheet main_scheme; Value: 100nF; Package: 0402; Supplier 1: Mouser; Supplier Part Number 1: 80-C0402C104K3R; ComponentLink1Description: myLinks; ComponentLink1URL: https://eu.mouser.com/ProductDetail/KEMET/C0402C104K3RACTU?qs=YCcZ0GhAU2q7BaxZ%2FluQHA%3D%3D
U9-U11 = ShiftRegister - SN74AHCT595PWR: 8-Bit Shift Registers With 3-State Output Registers, PW0016A, LARGE T&R; Value: 8bit - 5VPwr - 3V3 compatible logic; Package: TSSOP-16; PartNumber: SN74AHCT595PWR; ComponentLink1Description: myLinks; ComponentLink1URL: https://cz.mouser.com/ProductDetail/?qs=spW5eSrOWB5KP%2FLOxGLzFA%3D%3D; Supplier 1: Mouser; Supplier Part Number 1: 595-SN74AHCT595PWR